# Altium project C27337A_NI_STS_IFX_C55SOI_302149633_V3_04.PrjPcb (part 1 of 2)
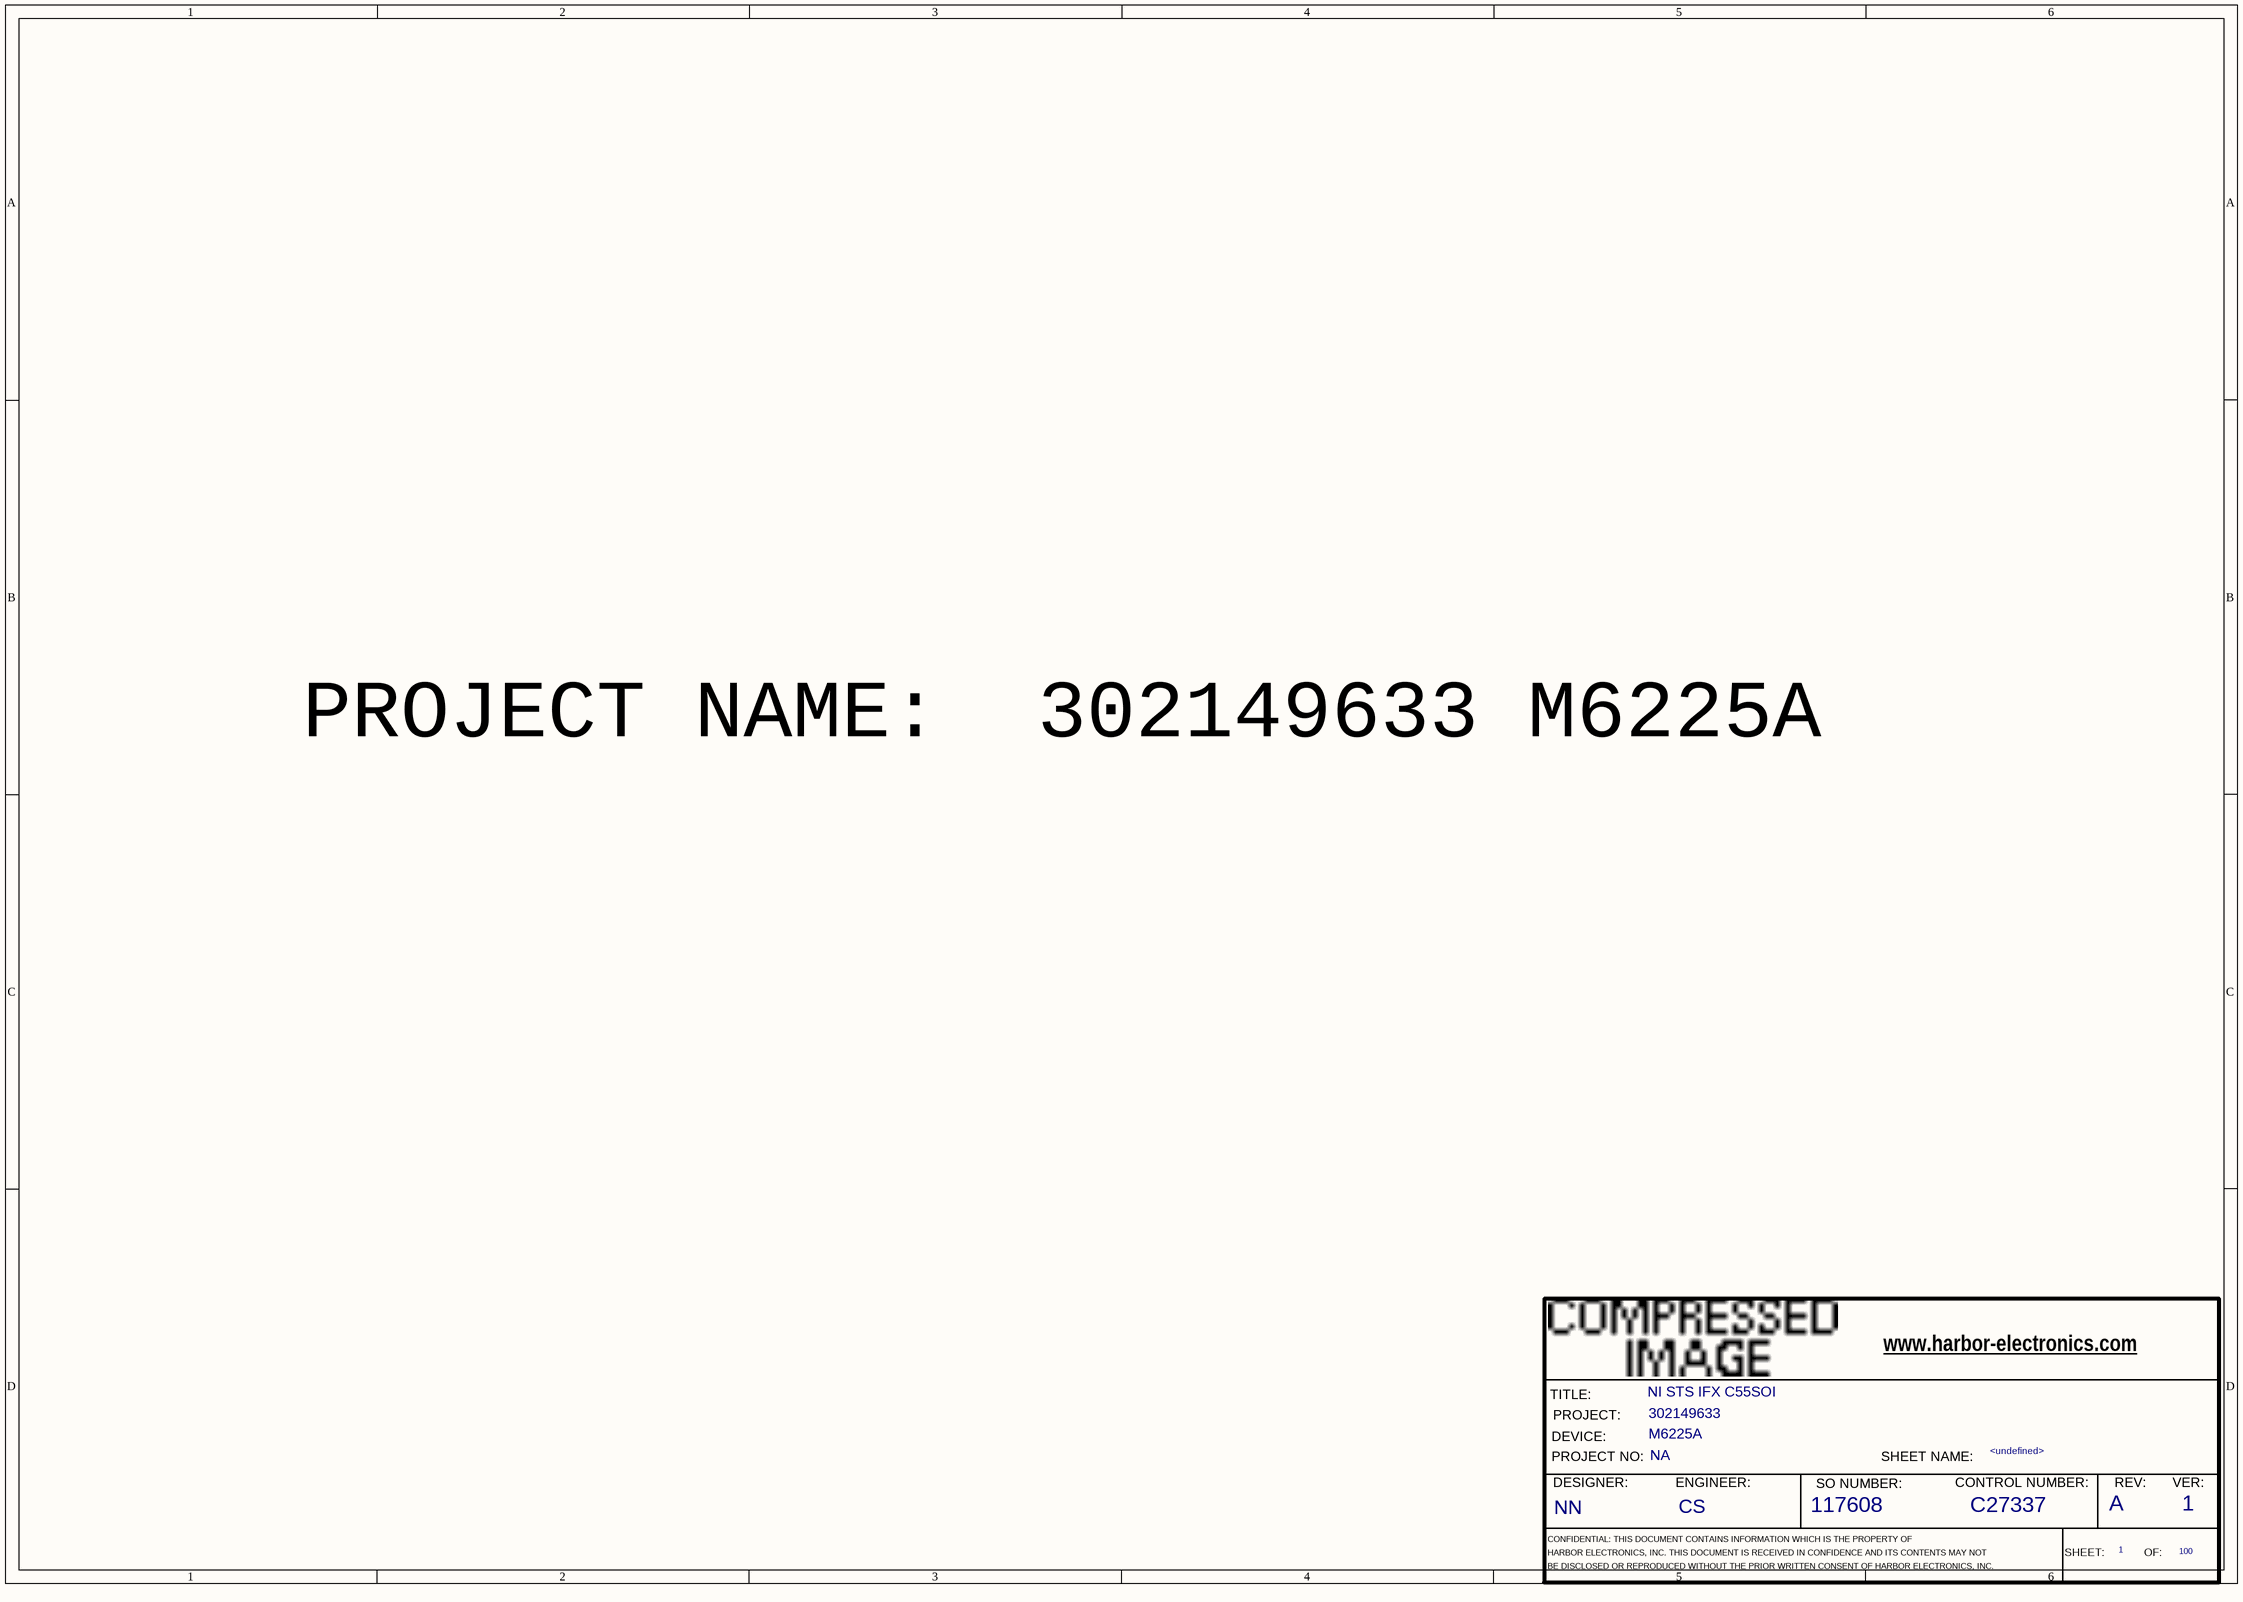
[diagram p0: 01-TITLE.SchDoc]
14 sheets, 208 parts. Net scope: flat (ports and power ports of the same name join across sheets).
Board file: c27337a_ni_sts_ifx_c55soi_302149633_m6225a_v1_23.brd.PcbDoc
Sheets:
  01-TITLE.SchDoc
  02-REVISION.SchDoc
  03-TESTER_CONFIG.SchDoc
  04-DUT0-1.SchDoc
  05-DUT2-3.SchDoc
  40-DIGITAL.SchDoc
  41-DIGITIZERS.SchDoc
  42-MIO.SchDoc
  43-PSU_SMU_HP.SchDoc
  45-RELAY_MUX_SWITCH.SchDoc
  47-SOURCES_AWG.SchDoc
  50-BLANK 101-120.SchDoc
  51-BLANK 121-140.SchDoc
  53-BLANK 161-180.SchDoc

## Sheet 01-TITLE.SchDoc
size 420 x 297 mm

### Parts
(Parts that share a designator on the sheet are numbered #1, #2 ... from top to bottom, then left to right.)
*#1  RevCode: A  Title: NI STS IFX C55SOI  Page Number: 1  Page Count: 100  Engineer: CS  Designer: NN  SO Number: 117608  Control Number: C27337  Page Name: <undefined>  PROJECT: 302149633  DEVICE: M6225A  PROJECT NO.: NA  (hidden comment: HE_DEFAULT)  (graphical)

### Notes on the sheet
- PROJECT NAME:  302149633 M6225A
- (in symbol HE_DEFAULT) www.harbor-electronics.com; TITLE:; PROJECT:; DEVICE:; PROJECT NO:; SHEET NAME:; DESIGNER:; ENGINEER:; CONTROL NUMBER:; REV:; VER:; SO NUMBER:; CONFIDENTIAL: THIS DOCUMENT CONTAINS INFORMATION WHICH IS THE PROPERTY OF; HARBOR ELECTRONICS, INC. THIS DOCUMENT IS RECEIVED IN CONFIDENCE AND ITS CONTENTS MAY NOT; SHEET:; OF:; BE DISCLOSED OR REPRODUCED WITHOUT THE PRIOR WRITTEN CONSENT OF HARBOR ELECTRONICS, INC.

### Library data of the parts
*#1 = HE_DEFAULT: Page Size: X; OrgAddr4: Fax: +1 602-431-9633; OrgAddr1: 4050 E. Cotton Center Blvd., Suite 33; OrgAddr2: Phoenix, Arizona 85040 U.S.A.; OrgAddr3: Phone: +1 602-438-1112; Doc: <Title Name>; OrgName: HARBOR; Version: 1

## Sheet 02-REVISION.SchDoc
size 420 x 297 mm
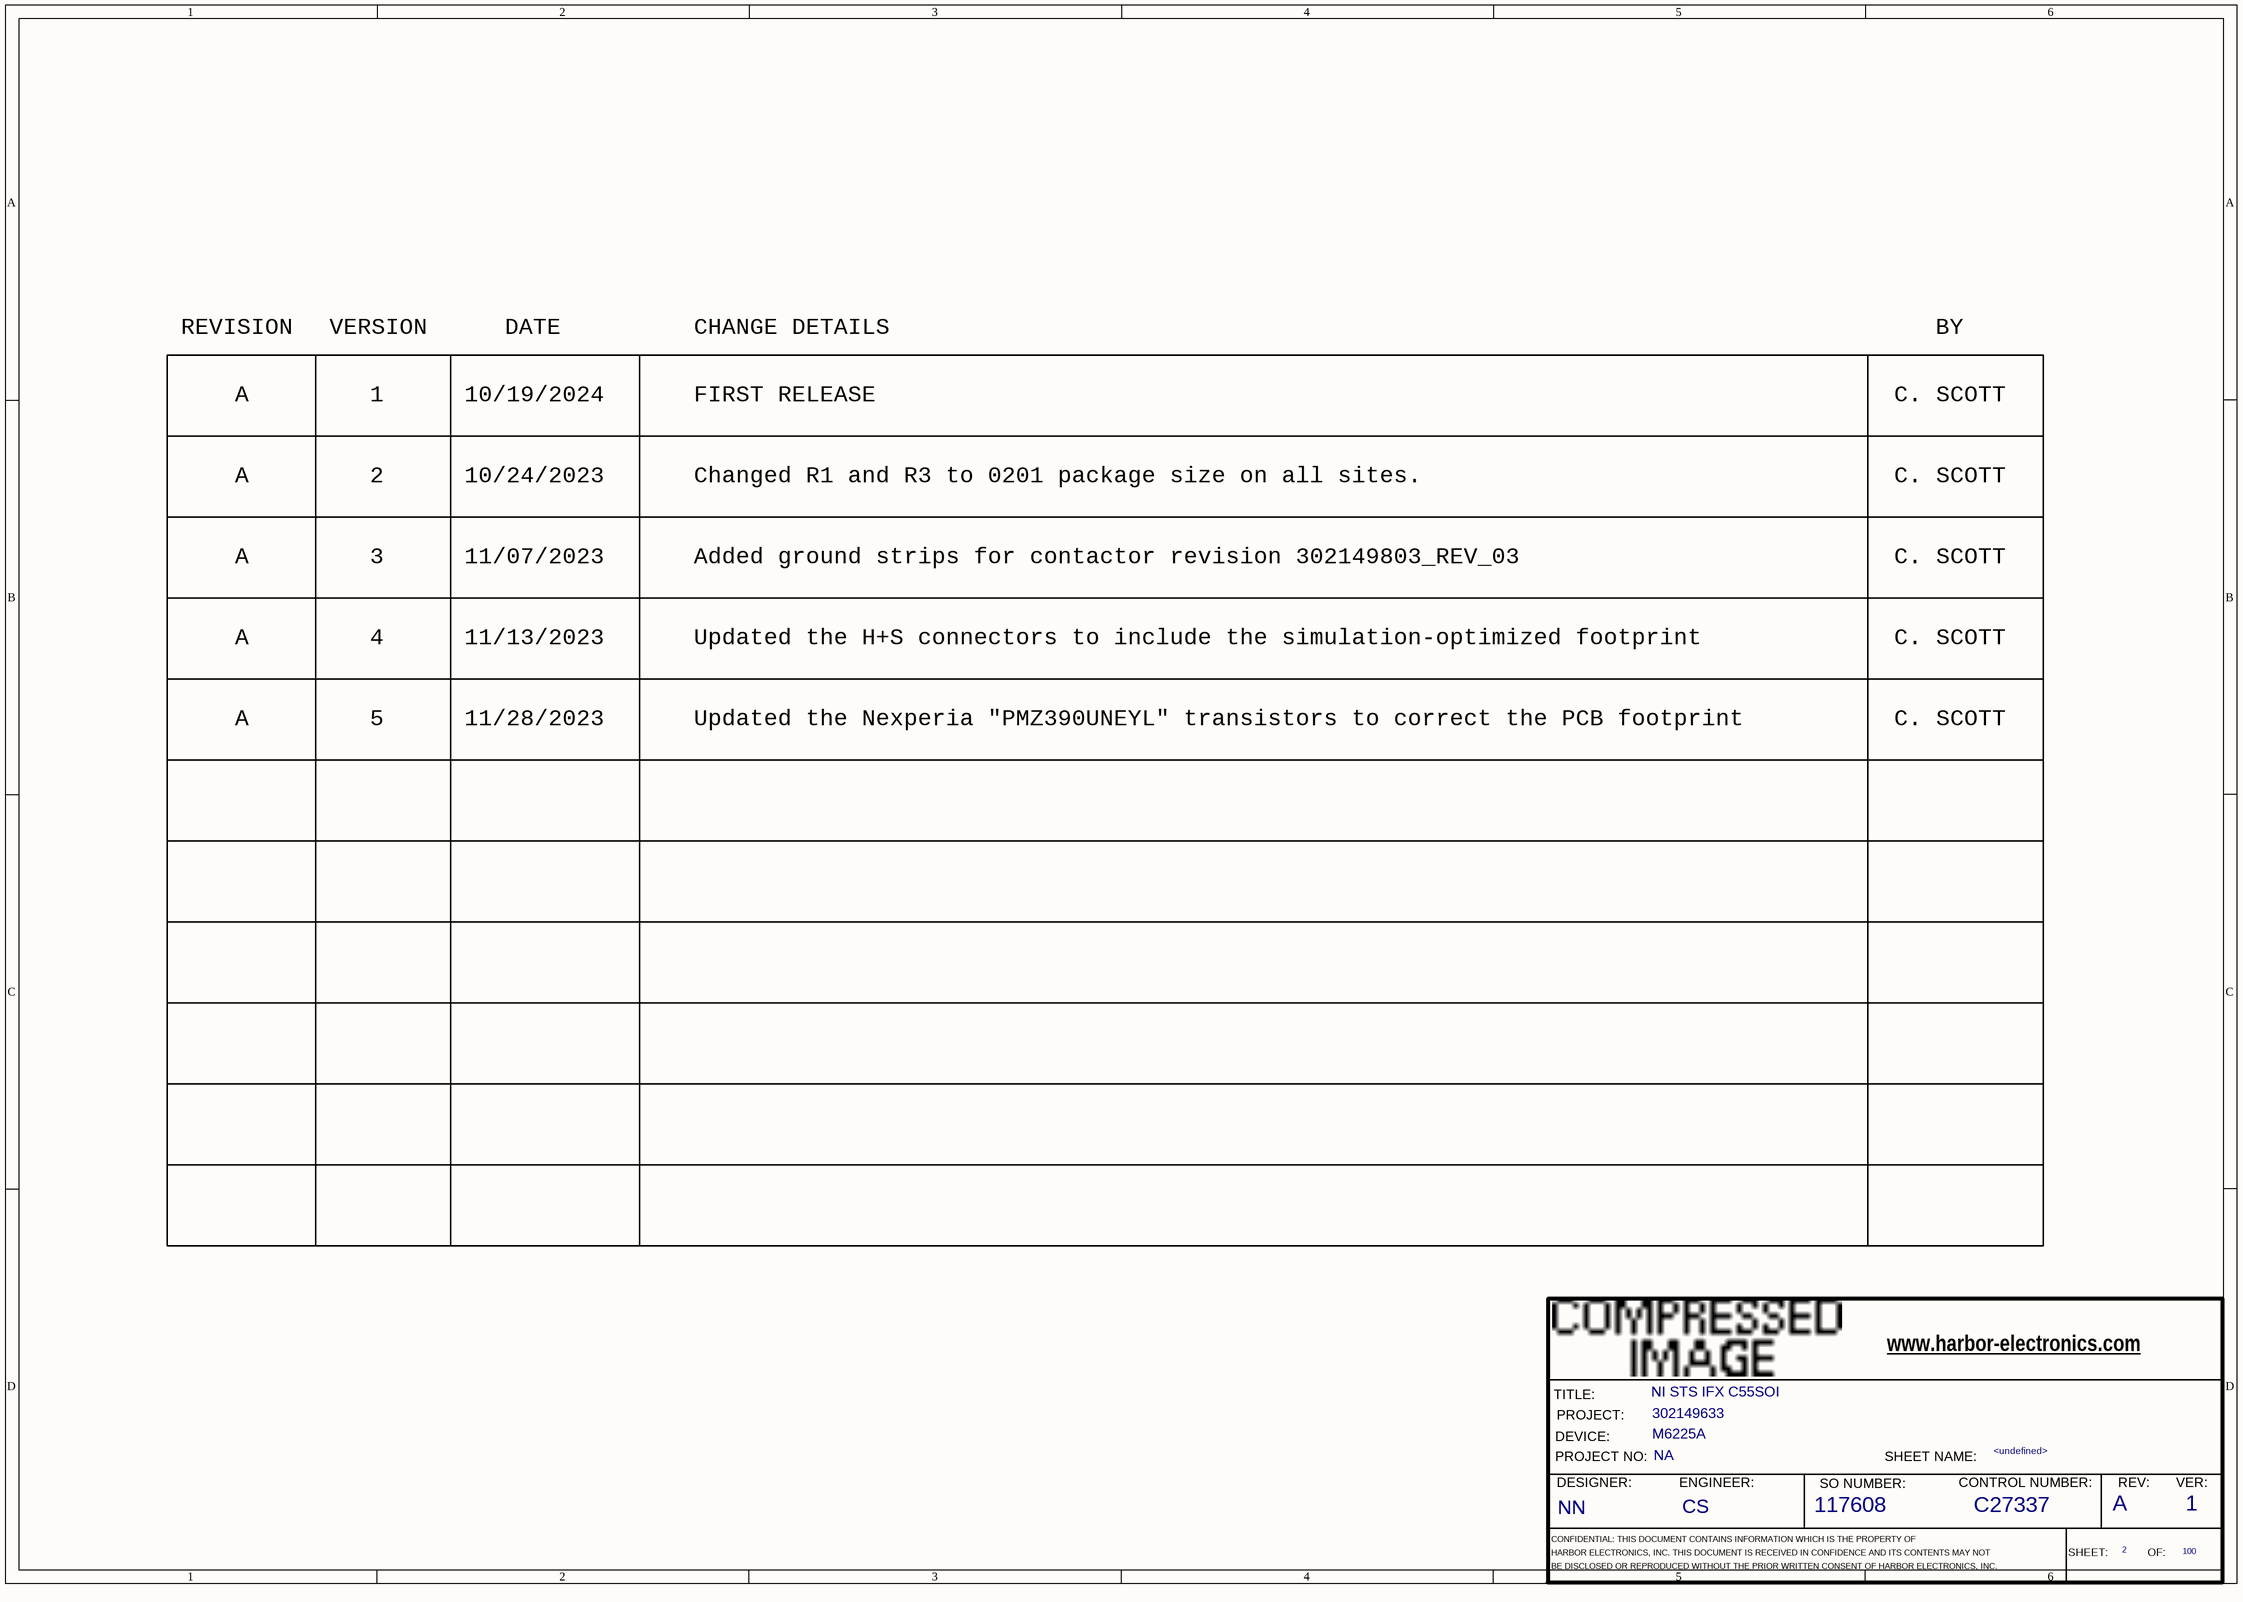
[diagram p1: 02-REVISION.SchDoc]

### Parts
(Parts that share a designator on the sheet are numbered #1, #2 ... from top to bottom, then left to right.)
*#2  RevCode: A  Title: NI STS IFX C55SOI  Page Number: 2  Page Count: 100  Engineer: CS  Designer: NN  SO Number: 117608  Control Number: C27337  Version: 1  Page Name: <undefined>  PROJECT: 302149633  DEVICE: M6225A  PROJECT NO.: NA  (hidden comment: HE_DEFAULT)  (graphical)

### Notes on the sheet
- REVISION
- VERSION
- DATE
- CHANGE DETAILS
- BY
- A
- 1
- 10/19/2024
- FIRST RELEASE
- C. SCOTT
- 2
- 10/24/2023
- Changed R1 and R3 to 0201 package size on all sites.
- 3
- 11/07/2023
- Added ground strips for contactor revision 302149803_REV_03
- 4
- 11/13/2023
- Updated the H+S connectors to include the simulation-optimized footprint
- 5
- 11/28/2023
- Updated the Nexperia "PMZ390UNEYL" transistors to correct the PCB footprint
- (in symbol HE_DEFAULT) www.harbor-electronics.com; TITLE:; PROJECT:; DEVICE:; PROJECT NO:; SHEET NAME:; DESIGNER:; ENGINEER:; CONTROL NUMBER:; REV:; VER:; SO NUMBER:; CONFIDENTIAL: THIS DOCUMENT CONTAINS INFORMATION WHICH IS THE PROPERTY OF; HARBOR ELECTRONICS, INC. THIS DOCUMENT IS RECEIVED IN CONFIDENCE AND ITS CONTENTS MAY NOT; SHEET:; OF:; BE DISCLOSED OR REPRODUCED WITHOUT THE PRIOR WRITTEN CONSENT OF HARBOR ELECTRONICS, INC.

### Library data of the parts
*#2 = HE_DEFAULT: as *#1 on sheet 01-TITLE

## Sheet 03-TESTER_CONFIG.SchDoc
size 594 x 420 mm
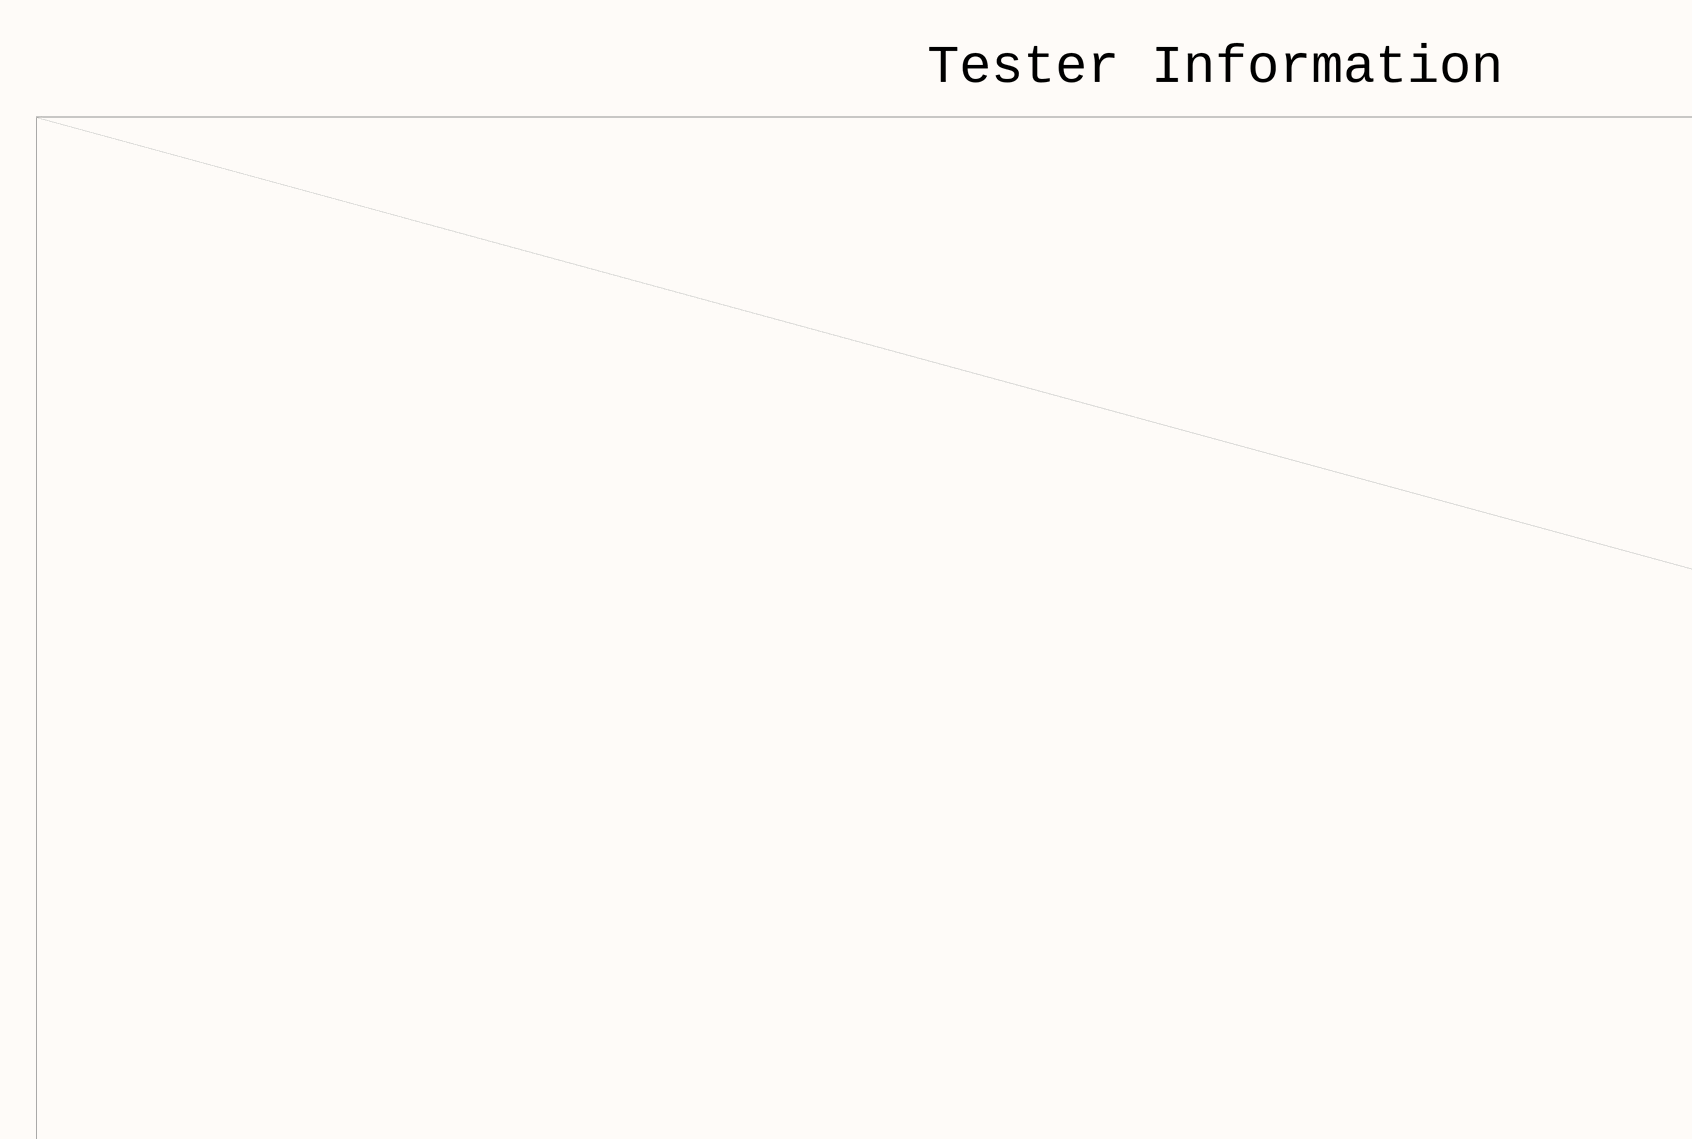
[diagram p2: 03-TESTER_CONFIG.SchDoc, top column 1 of 4]
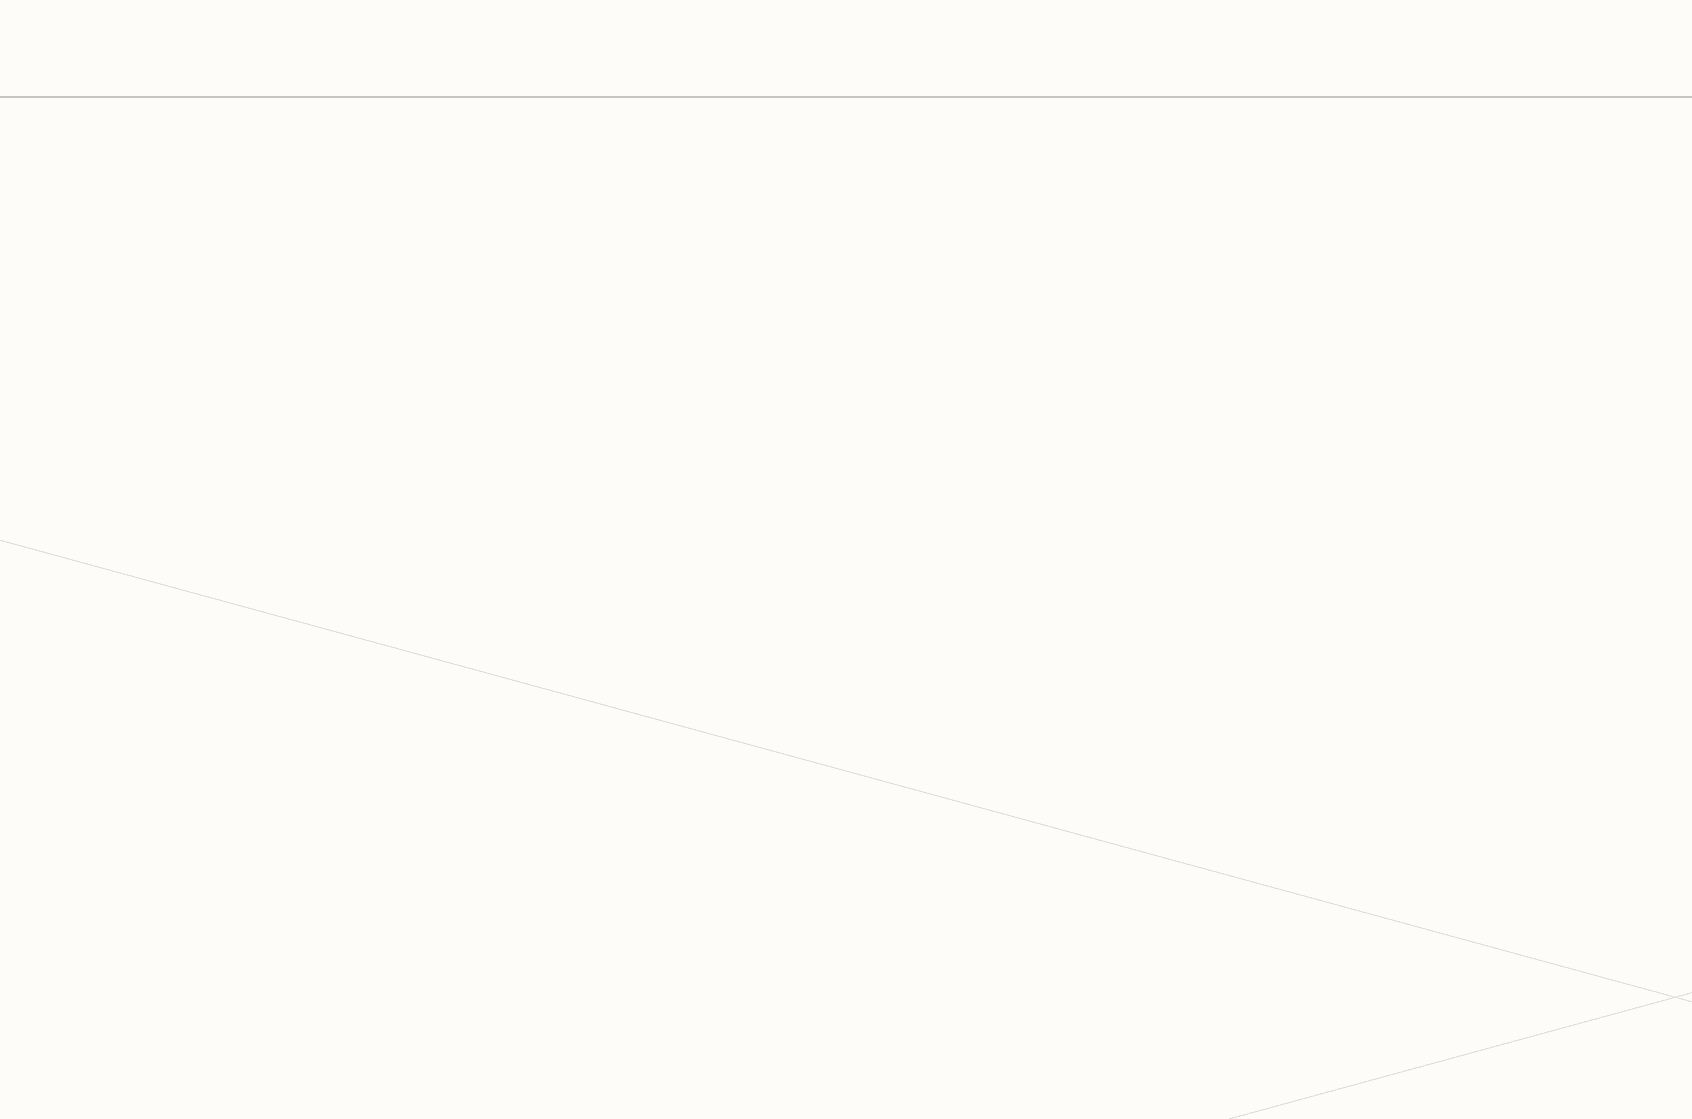
[diagram p3: 03-TESTER_CONFIG.SchDoc, top column 2 of 4]
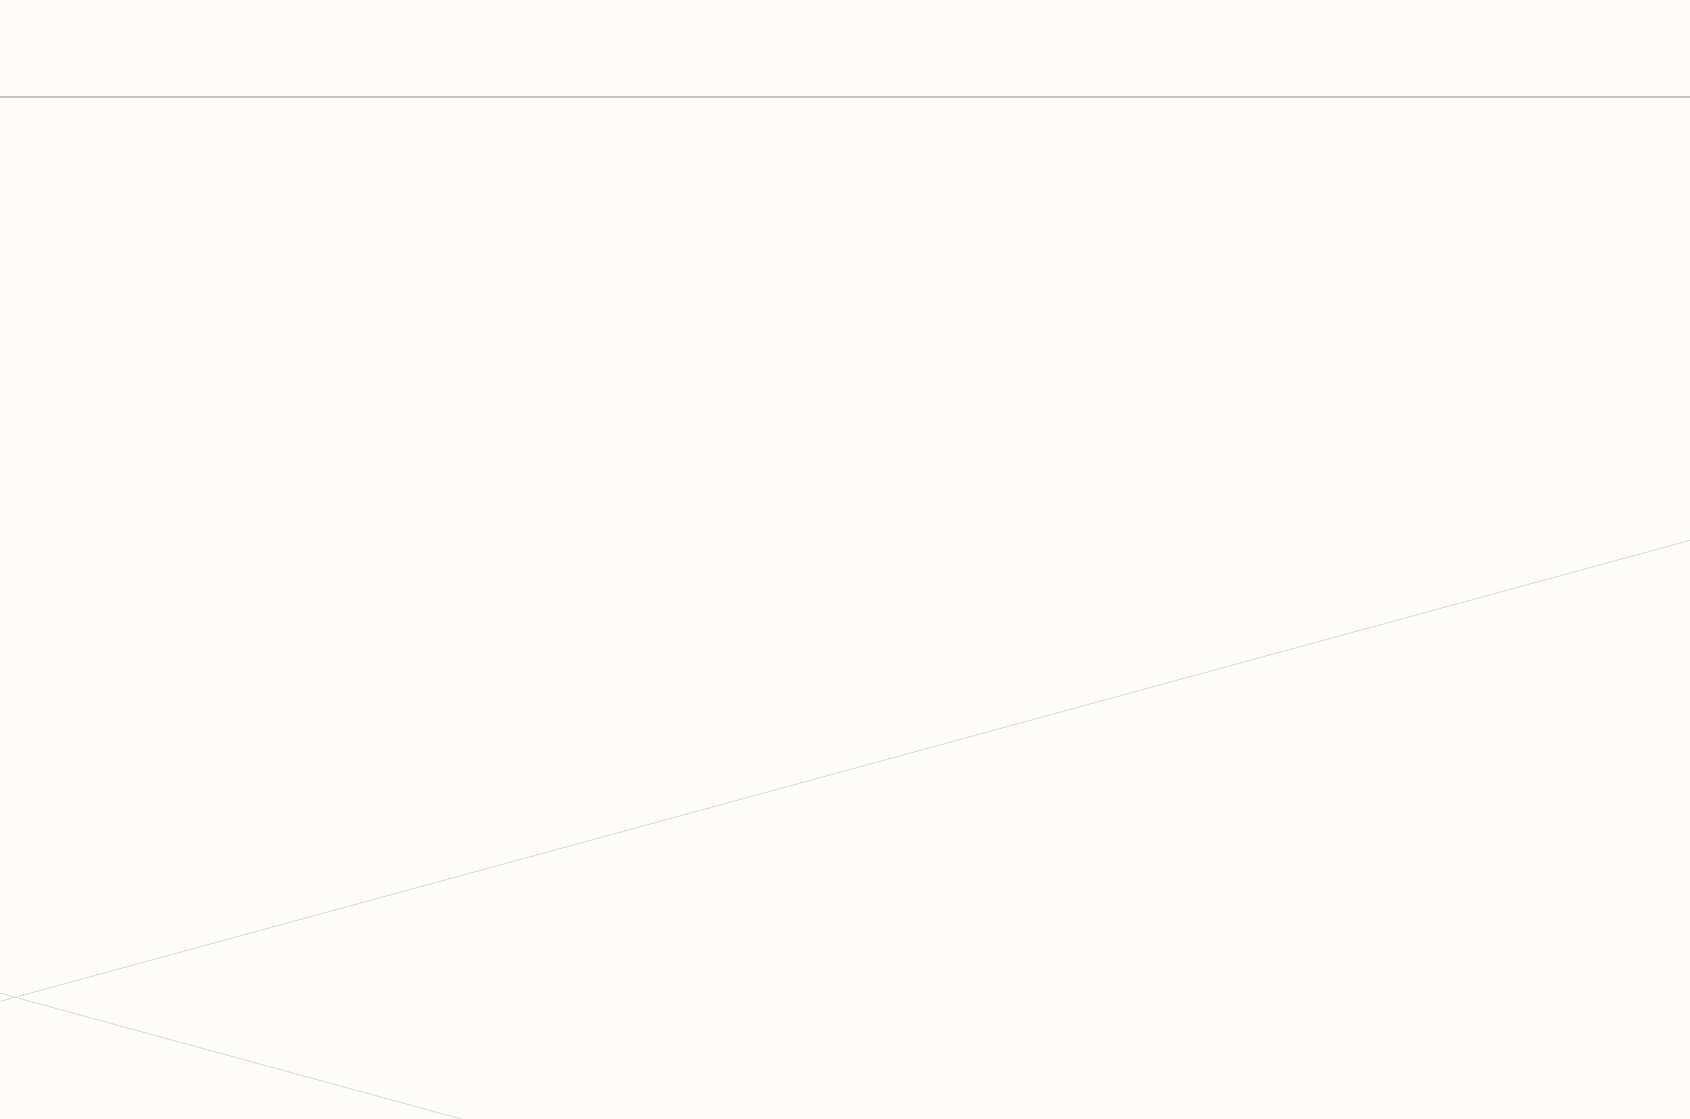
[diagram p4: 03-TESTER_CONFIG.SchDoc, top column 3 of 4]
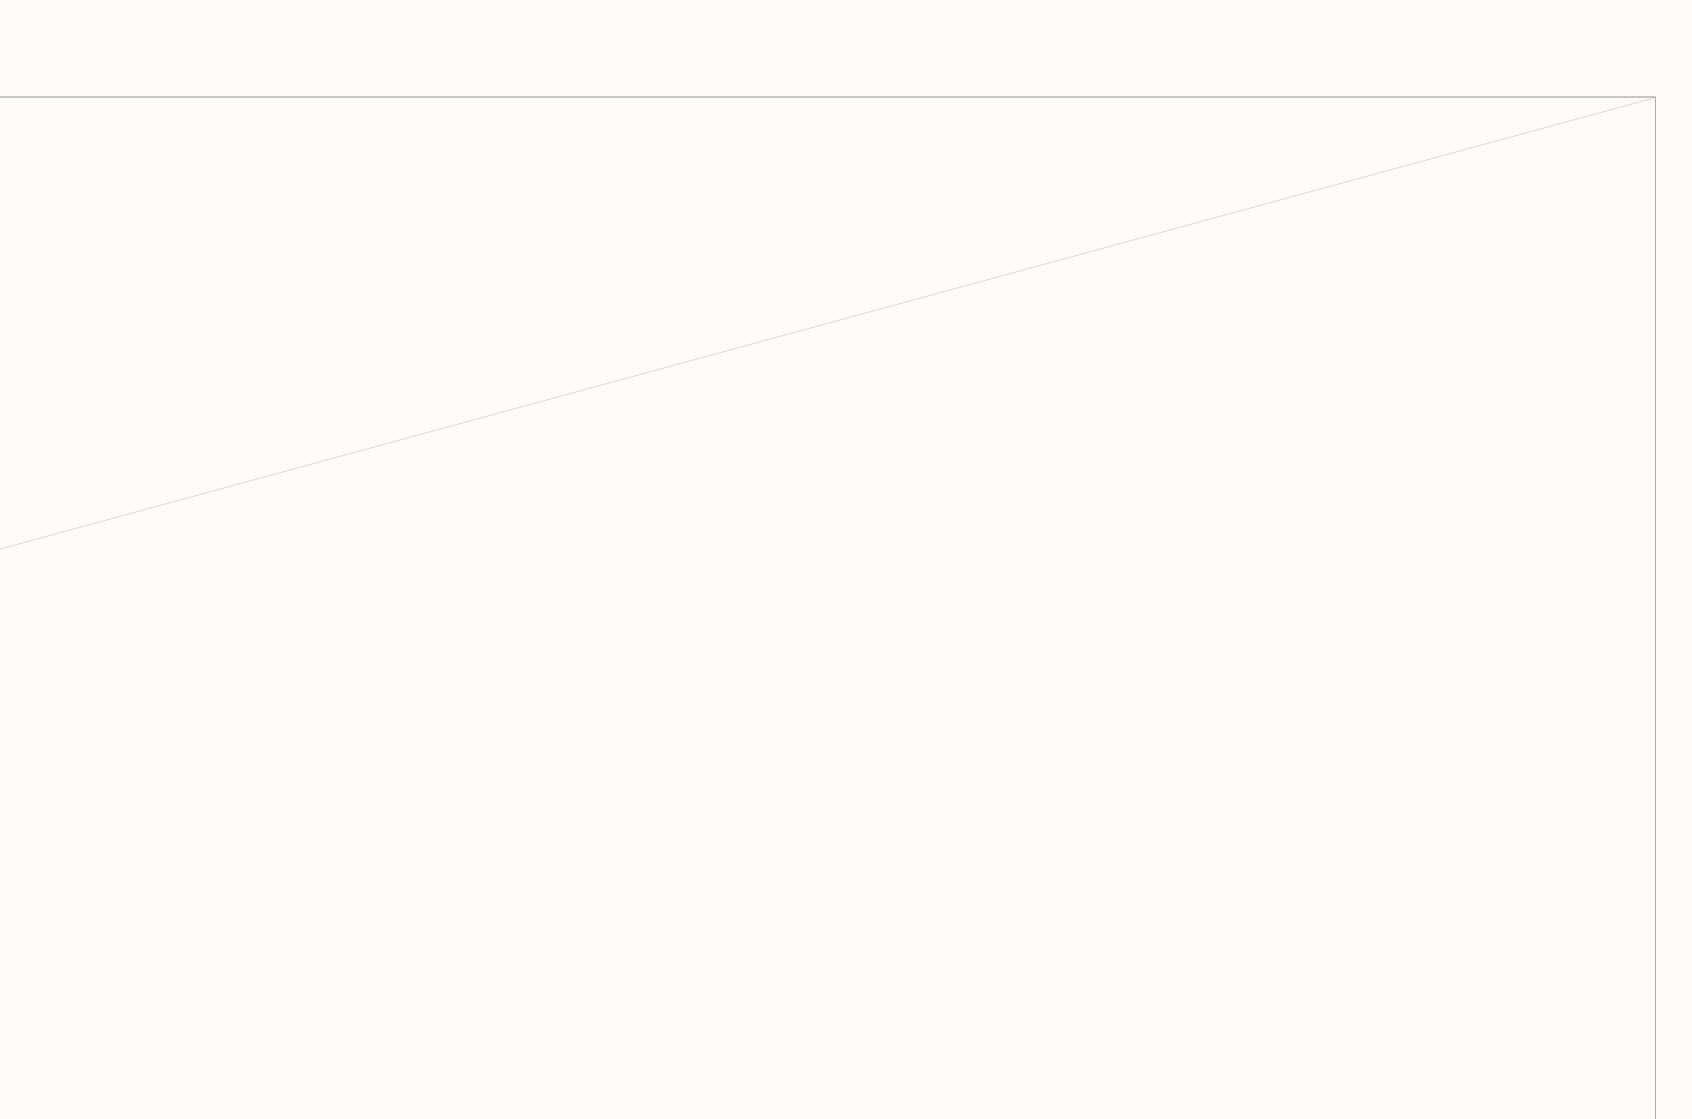
[diagram p5: 03-TESTER_CONFIG.SchDoc, top column 4 of 4]
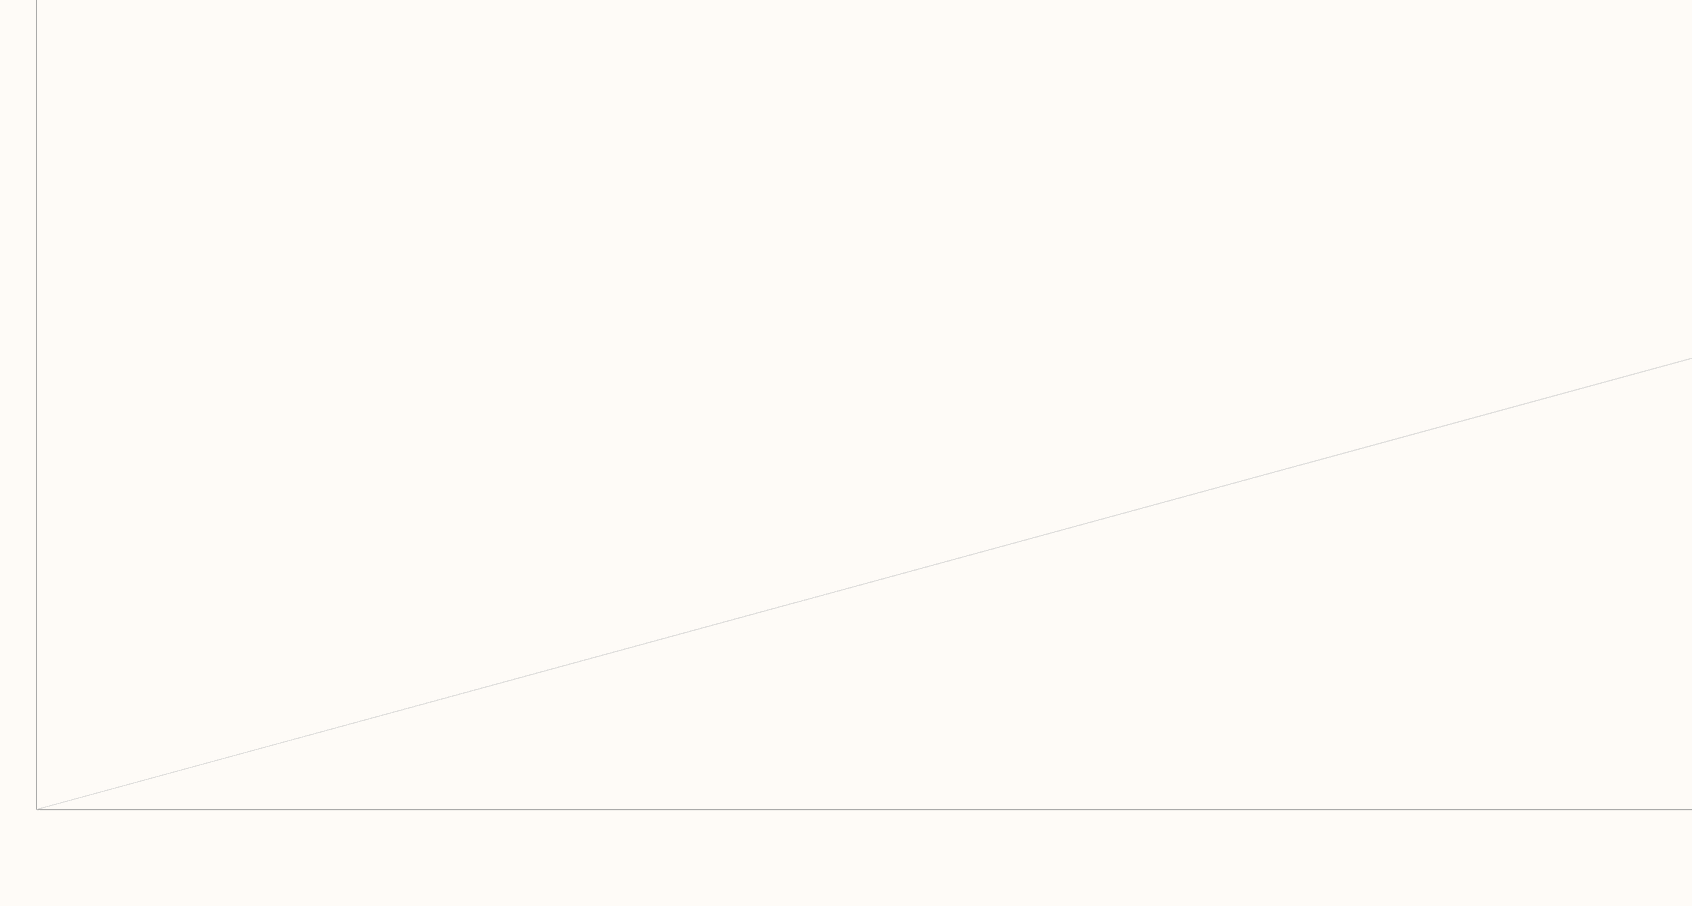
[diagram p6: 03-TESTER_CONFIG.SchDoc, bottom column 1 of 4]
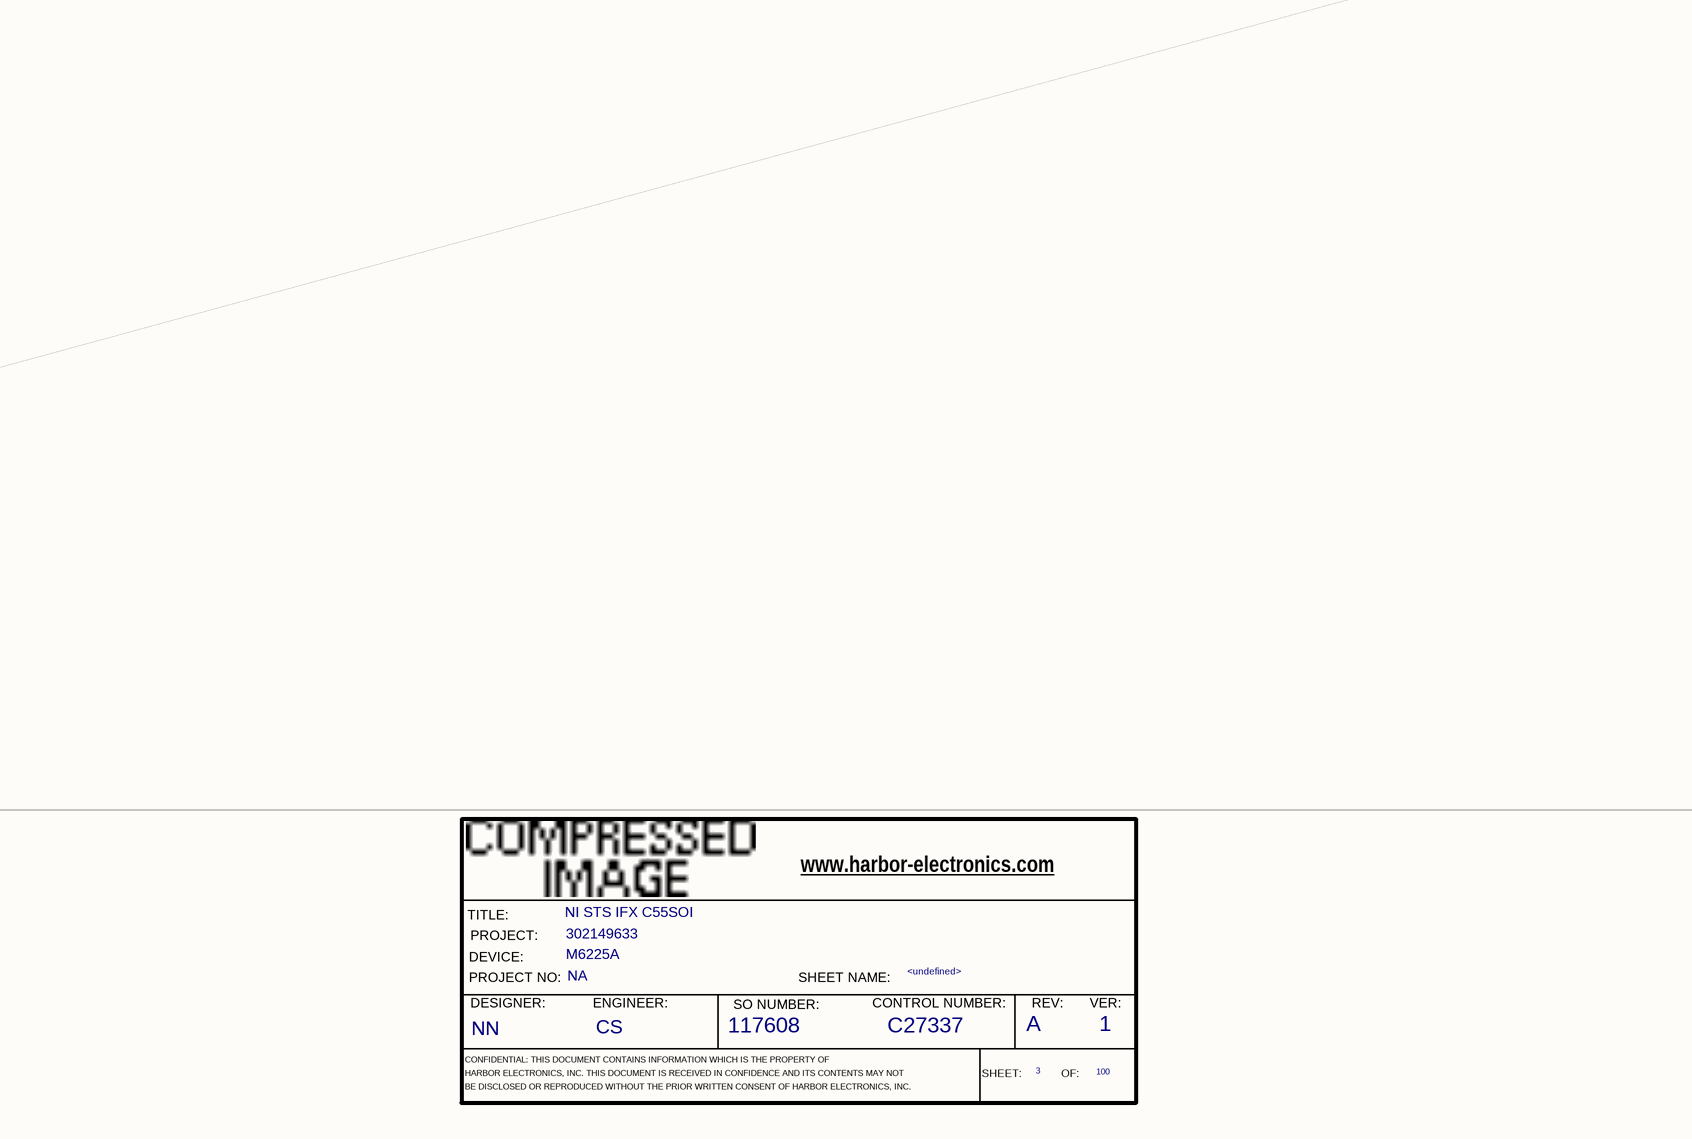
[diagram p7: 03-TESTER_CONFIG.SchDoc, bottom column 2 of 4]
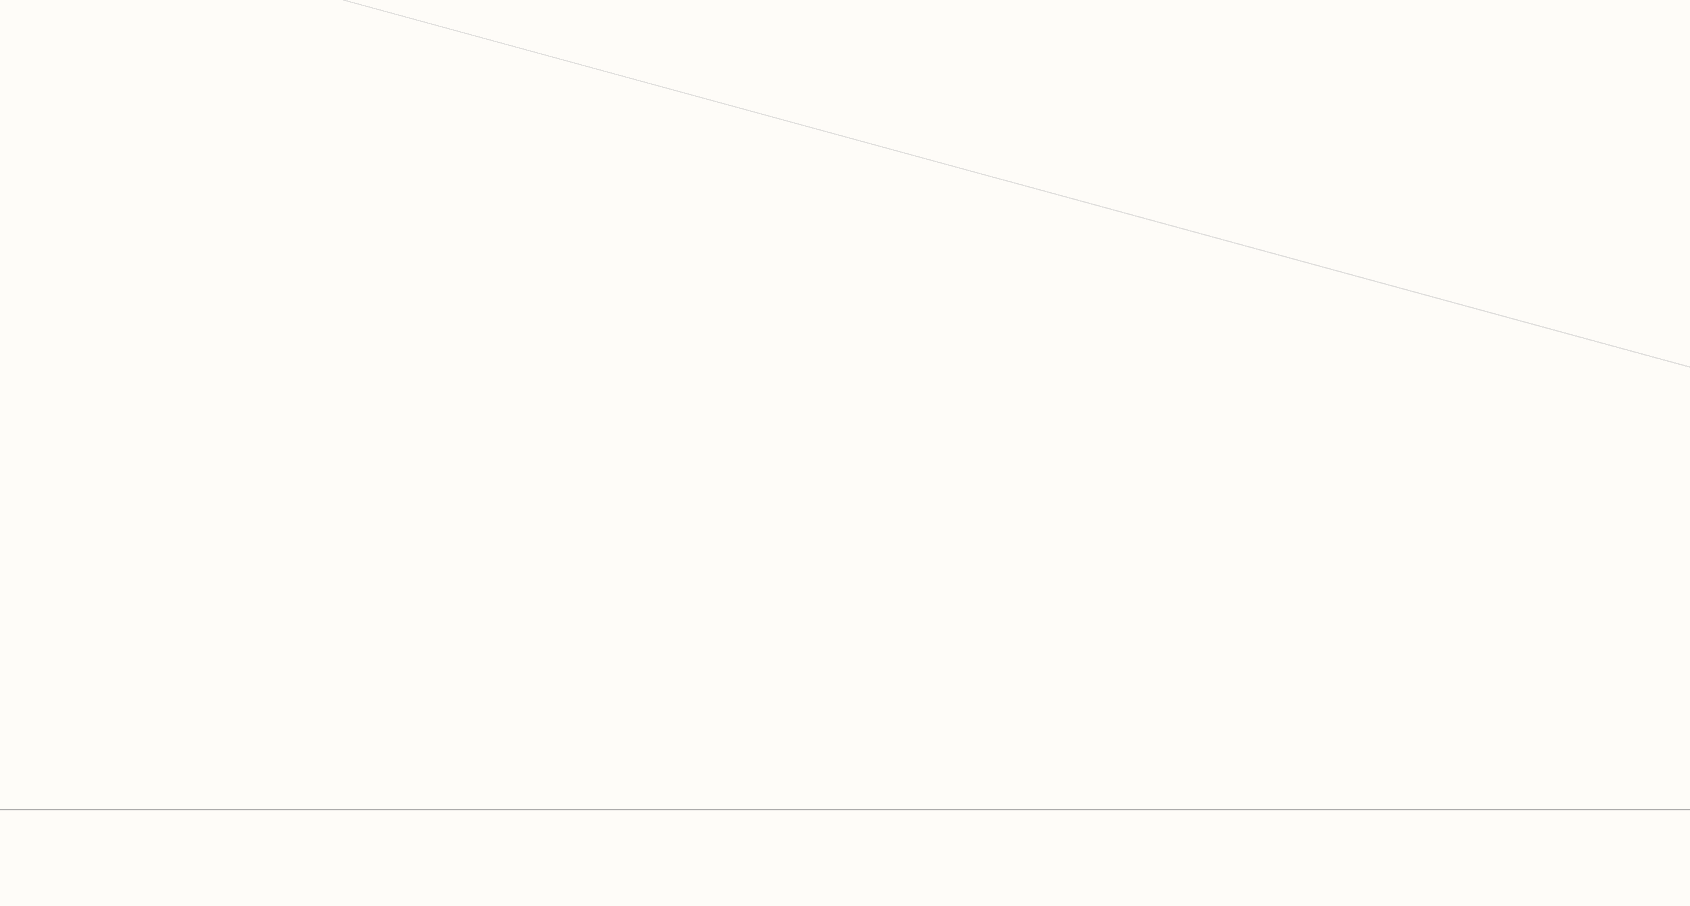
[diagram p8: 03-TESTER_CONFIG.SchDoc, bottom column 3 of 4]
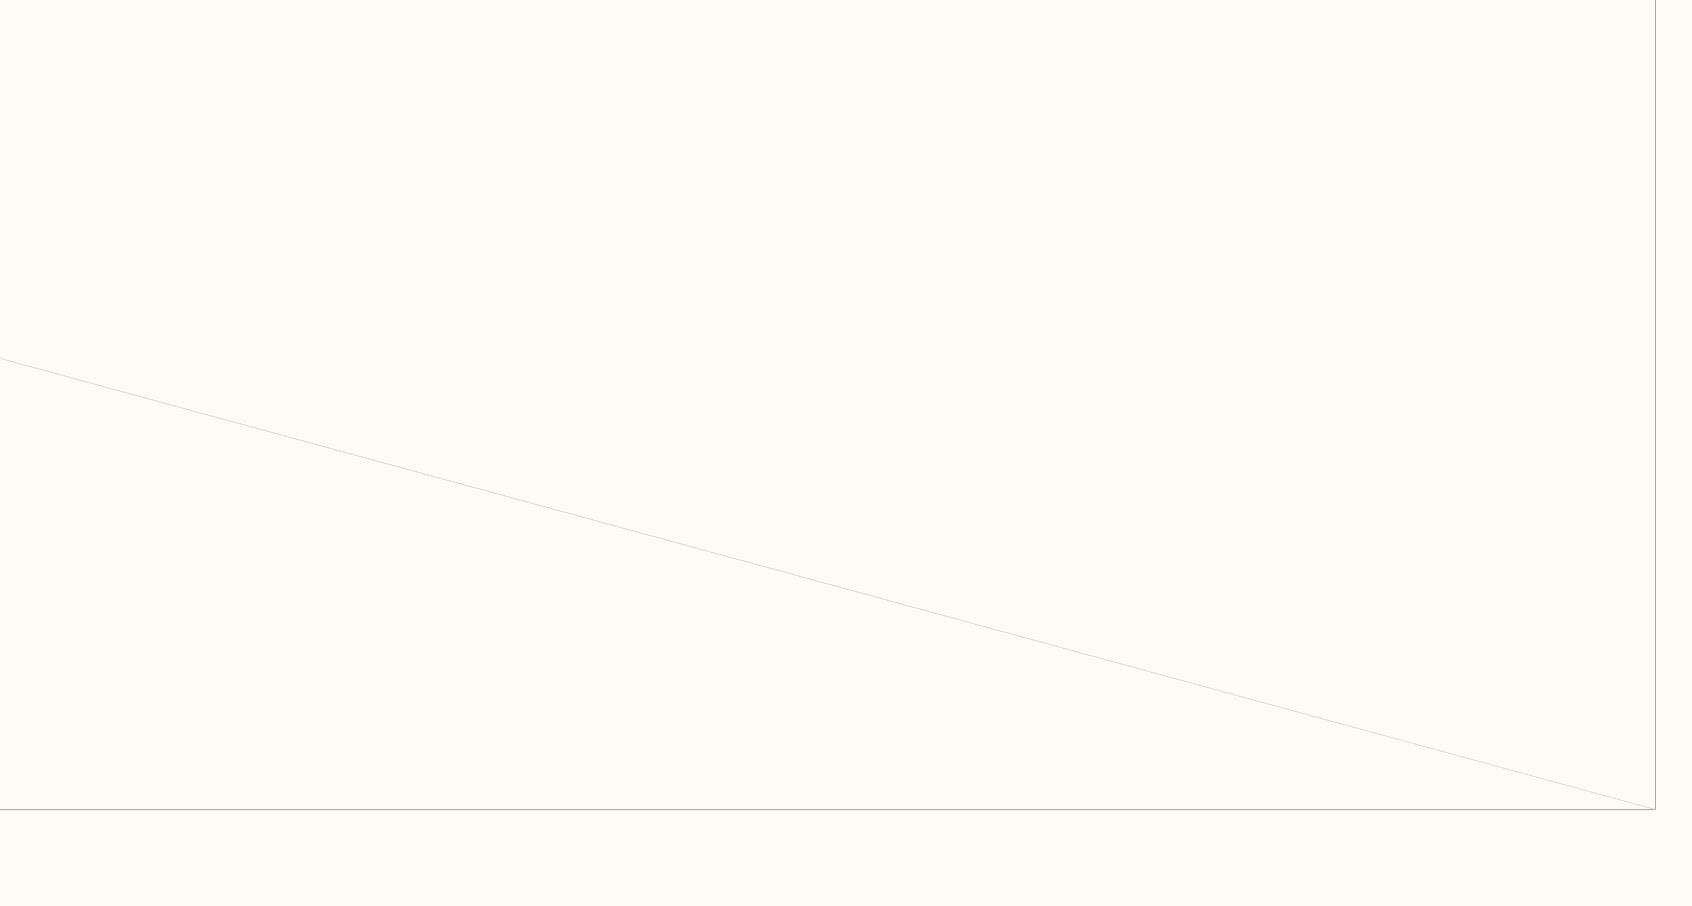
[diagram p9: 03-TESTER_CONFIG.SchDoc, bottom column 4 of 4]

### Parts
(Parts that share a designator on the sheet are numbered #1, #2 ... from top to bottom, then left to right.)
*#3  RevCode: A  Title: NI STS IFX C55SOI  Page Number: 3  Page Count: 100  Engineer: CS  Designer: NN  SO Number: 117608  Control Number: C27337  Version: 1  Page Name: <undefined>  PROJECT: 302149633  DEVICE: M6225A  PROJECT NO.: NA  (hidden comment: HE_DEFAULT)  (graphical)

### Notes on the sheet
- Tester Information
- (in symbol HE_DEFAULT) www.harbor-electronics.com; TITLE:; PROJECT:; DEVICE:; PROJECT NO:; SHEET NAME:; DESIGNER:; ENGINEER:; SO NUMBER:; CONTROL NUMBER:; REV:; VER:; CONFIDENTIAL: THIS DOCUMENT CONTAINS INFORMATION WHICH IS THE PROPERTY OF; HARBOR ELECTRONICS, INC. THIS DOCUMENT IS RECEIVED IN CONFIDENCE AND ITS CONTENTS MAY NOT; SHEET:; OF:; BE DISCLOSED OR REPRODUCED WITHOUT THE PRIOR WRITTEN CONSENT OF HARBOR ELECTRONICS, INC.

### Library data of the parts
*#3 = HE_DEFAULT: as *#1 on sheet 01-TITLE

## Sheet 04-DUT0-1.SchDoc
size 594 x 420 mm
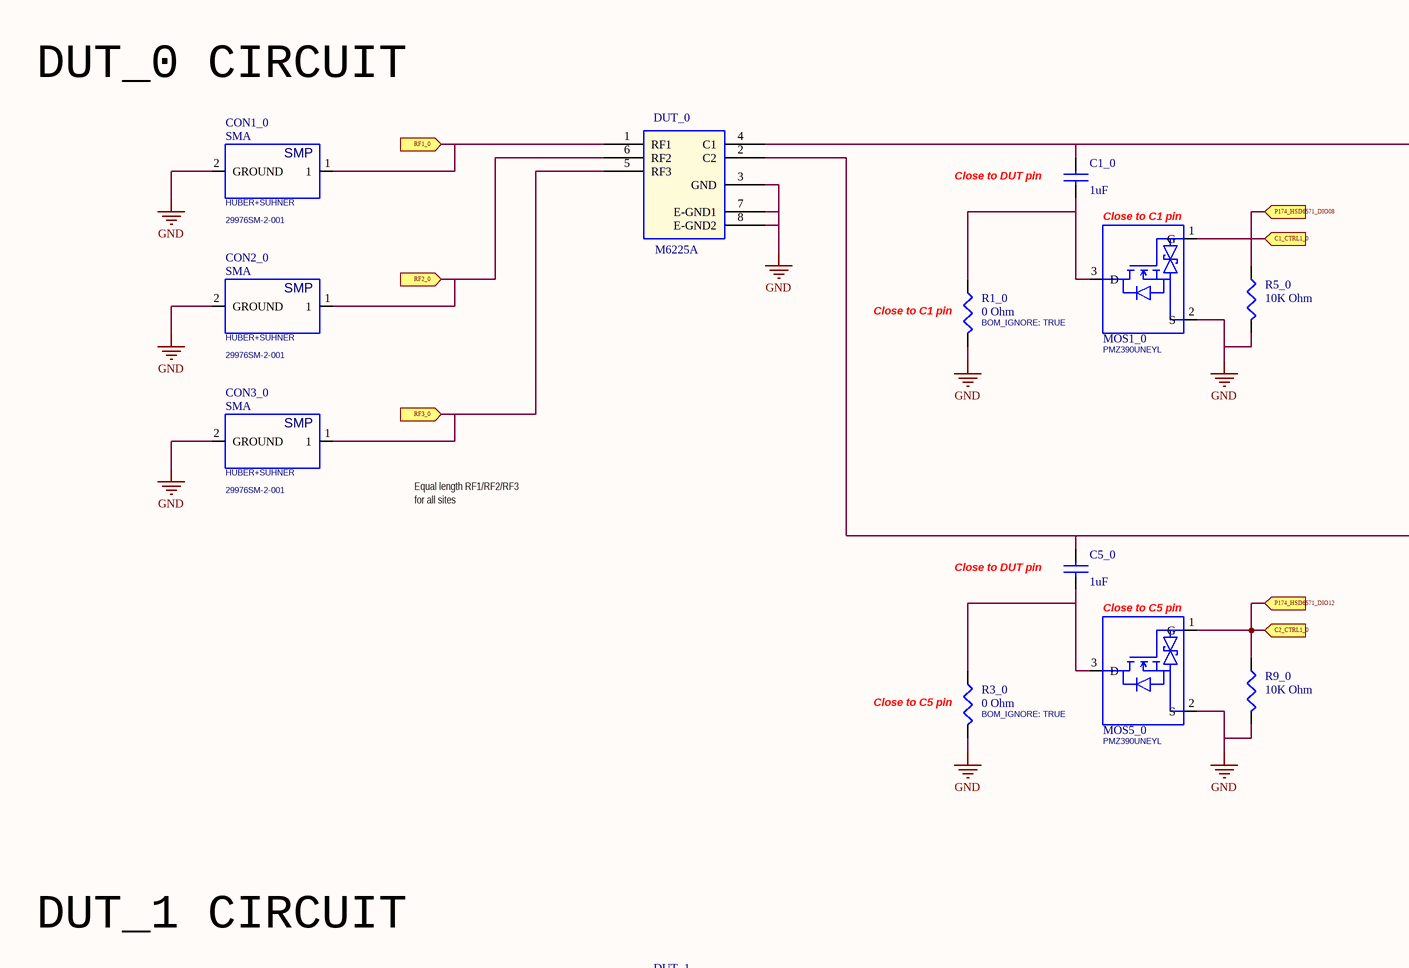
[diagram p10: 04-DUT0-1.SchDoc, top left]
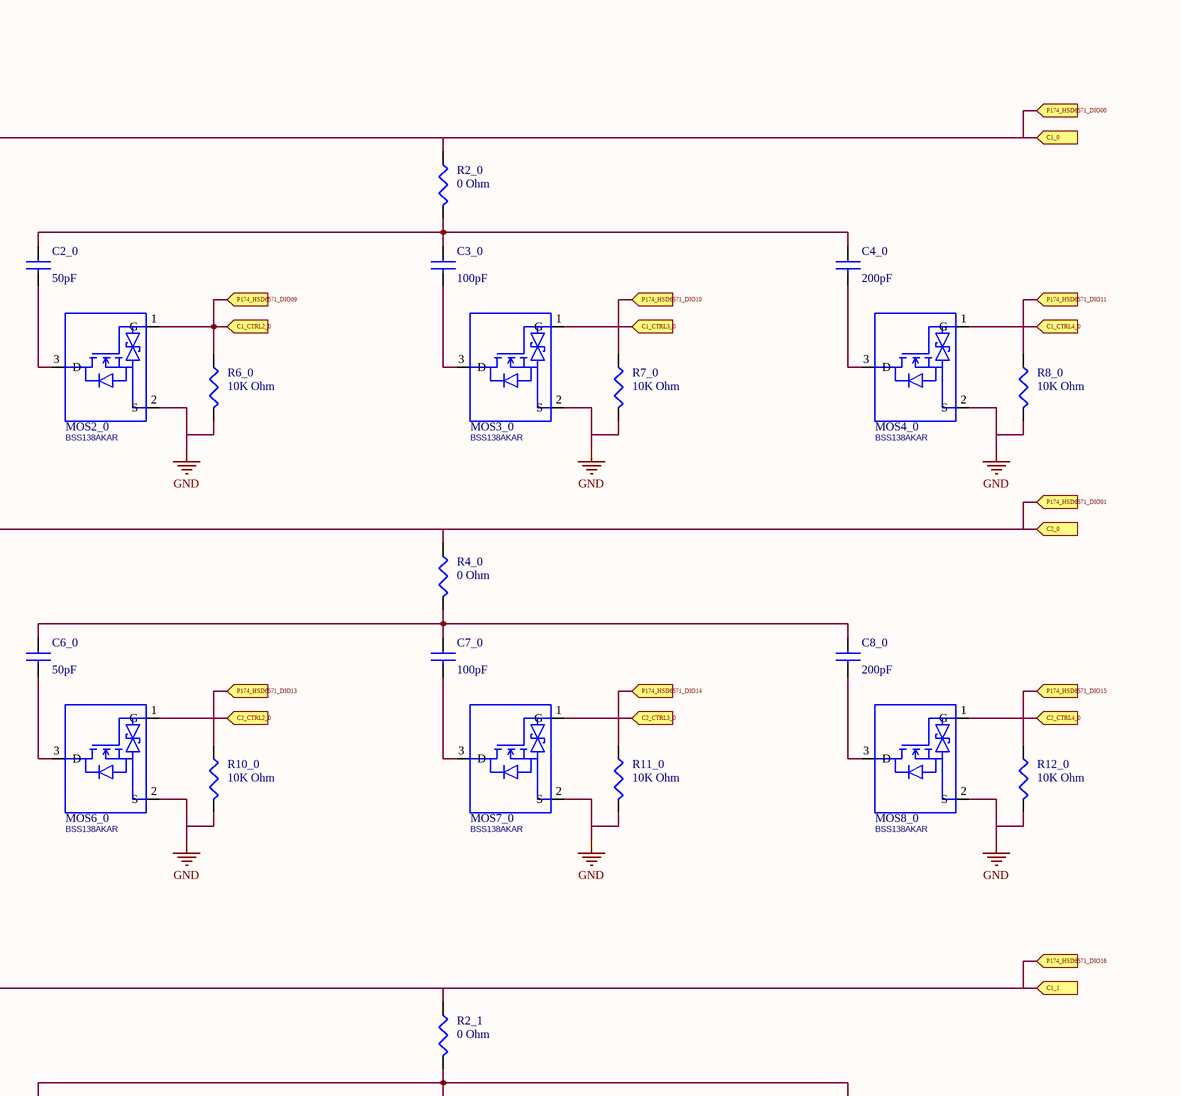
[diagram p11: 04-DUT0-1.SchDoc, top right]
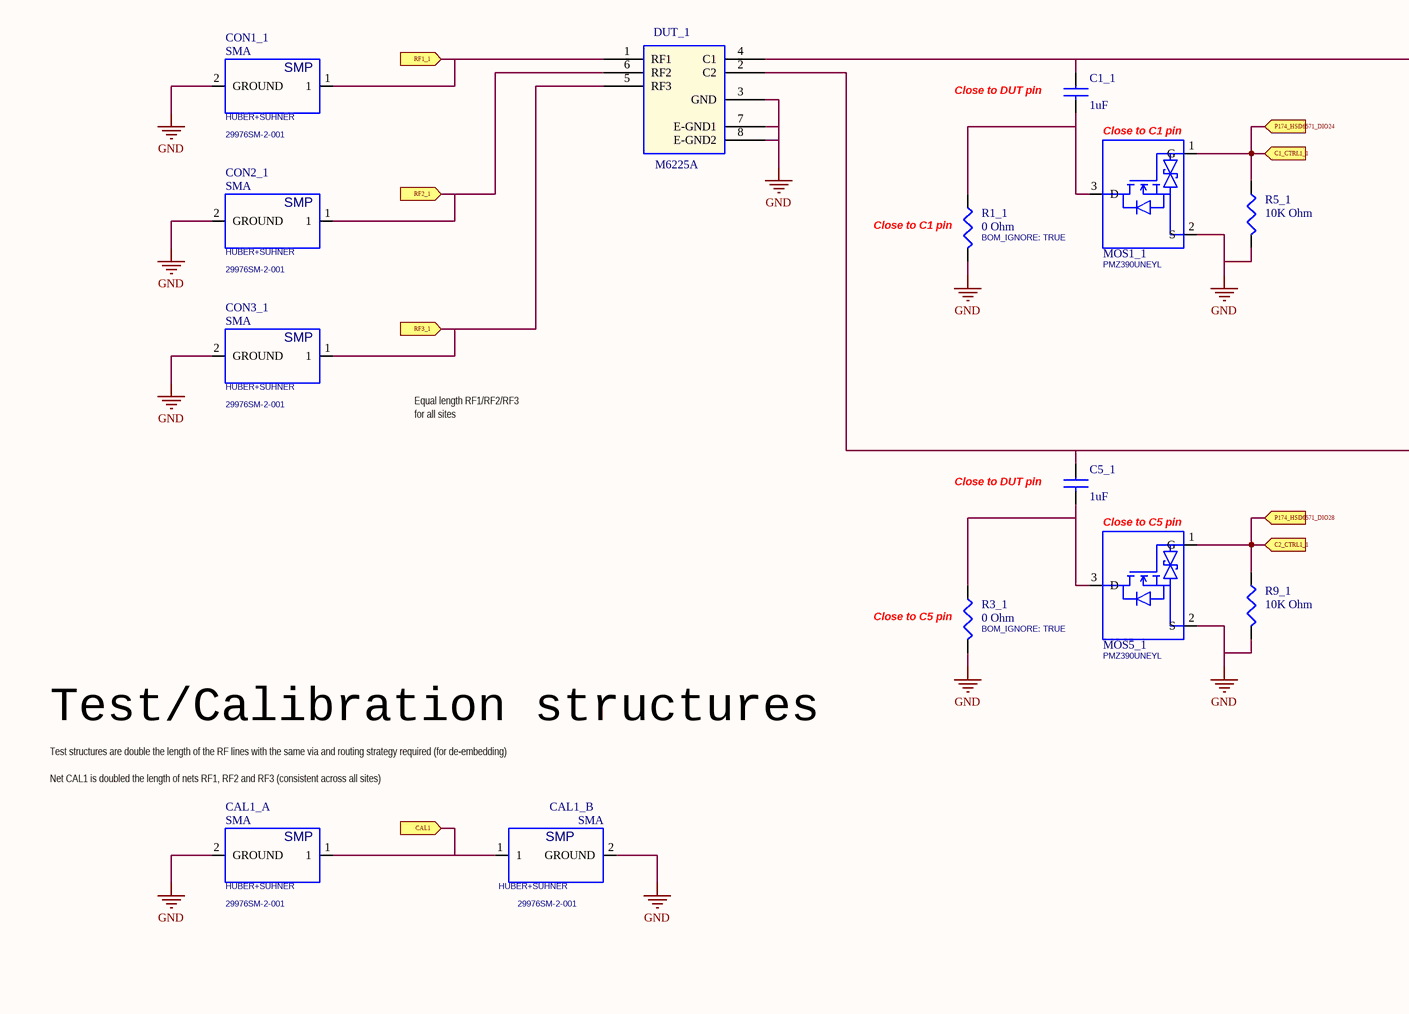
[diagram p12: 04-DUT0-1.SchDoc, bottom left]
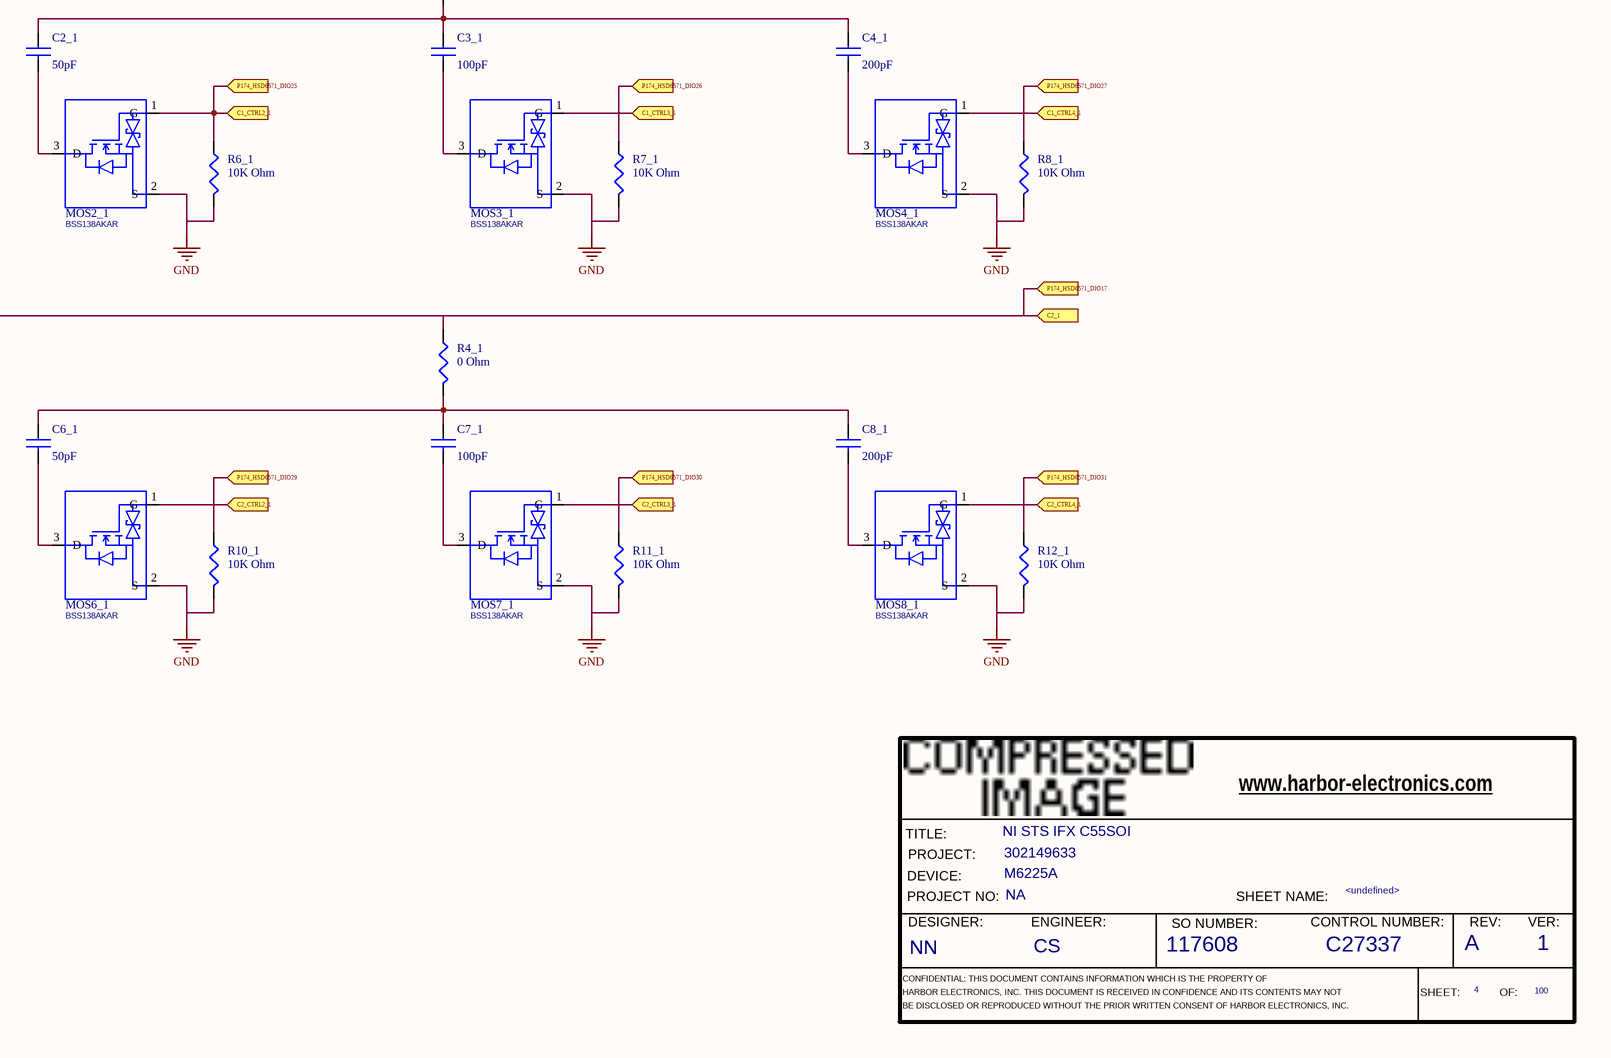
[diagram p13: 04-DUT0-1.SchDoc, bottom right]

### Parts
(Parts that share a designator on the sheet are numbered #1, #2 ... from top to bottom, then left to right.)
*#4  RevCode: A  Title: NI STS IFX C55SOI  Page Number: 4  Page Count: 100  Engineer: CS  Designer: NN  SO Number: 117608  Control Number: C27337  Version: 1  Page Name: <undefined>  PROJECT: 302149633  DEVICE: M6225A  PROJECT NO.: NA  (hidden comment: HE_DEFAULT)  (graphical)
C1_0  1uF  [CAPC1005X65NA]
C1_1  1uF  [CAPC1005X65NA]
C2_0  50pF  [CAPC2012X150NA]
C2_1  50pF  [CAPC2012X150NA]
C3_0  100pF  [CAPC2012X150NA]
C3_1  100pF  [CAPC2012X150NA]
C4_0  200pF  [CAPC2012X150NA]
C4_1  200pF  [CAPC2012X150NA]
C5_0  1uF  [CAPC1005X65NA]
C5_1  1uF  [CAPC1005X65NA]
C6_0  50pF  [CAPC2012X150NA]
C6_1  50pF  [CAPC2012X150NA]
C7_0  100pF  [CAPC2012X150NA]
C7_1  100pF  [CAPC2012X150NA]
C8_0  200pF  [CAPC2012X150NA]
C8_1  200pF  [CAPC2012X150NA]
CAL1_A  SMA  MANUFACTURER: HUBER+SUHNER  PART_NUMBER: 29976SM-2-001  [HUBER_SUHNER_29976SM_2_001NA]
CAL1_B  SMA  MANUFACTURER: HUBER+SUHNER  PART_NUMBER: 29976SM-2-001  [HUBER_SUHNER_29976SM_2_001NA]
CON1_0  SMA  MANUFACTURER: HUBER+SUHNER  PART_NUMBER: 29976SM-2-001  [HUBER_SUHNER_29976SM_2_001NA]
CON1_1  SMA  MANUFACTURER: HUBER+SUHNER  PART_NUMBER: 29976SM-2-001  [HUBER_SUHNER_29976SM_2_001NA]
CON2_0  SMA  PART_NUMBER: 29976SM-2-001  MANUFACTURER: HUBER+SUHNER  [HUBER_SUHNER_29976SM_2_001NA]
CON2_1  SMA  PART_NUMBER: 29976SM-2-001  MANUFACTURER: HUBER+SUHNER  [HUBER_SUHNER_29976SM_2_001NA]
CON3_0  SMA  PART_NUMBER: 29976SM-2-001  MANUFACTURER: HUBER+SUHNER  [HUBER_SUHNER_29976SM_2_001NA]
CON3_1  SMA  PART_NUMBER: 29976SM-2-001  MANUFACTURER: HUBER+SUHNER  [HUBER_SUHNER_29976SM_2_001NA]
DUT_0  M6225A  [dut_302149803]
DUT_1  M6225A  [dut_302149803]
MOS1_0  PART_NUMBER: PMZ390UNEYL  [DFN1006_3NB]  (hidden comment: SINGLE)
MOS1_1  PART_NUMBER: PMZ390UNEYL  [DFN1006_3NB]  (hidden comment: SINGLE)
MOS2_0  SINGLE  [SOT95P240X130_3NA]  (value not drawn)
MOS2_1  SINGLE  [SOT95P240X130_3NA]  (value not drawn)
MOS3_0  SINGLE  [SOT95P240X130_3NA]  (value not drawn)
MOS3_1  SINGLE  [SOT95P240X130_3NA]  (value not drawn)
MOS4_0  SINGLE  [SOT95P240X130_3NA]  (value not drawn)
MOS4_1  SINGLE  [SOT95P240X130_3NA]  (value not drawn)
MOS5_0  PART_NUMBER: PMZ390UNEYL  [DFN1006_3NB]  (hidden comment: SINGLE)
MOS5_1  PART_NUMBER: PMZ390UNEYL  [DFN1006_3NB]  (hidden comment: SINGLE)
MOS6_0  SINGLE  [SOT95P240X130_3NA]  (value not drawn)
MOS6_1  SINGLE  [SOT95P240X130_3NA]  (value not drawn)
MOS7_0  SINGLE  [SOT95P240X130_3NA]  (value not drawn)
MOS7_1  SINGLE  [SOT95P240X130_3NA]  (value not drawn)
MOS8_0  SINGLE  [SOT95P240X130_3NA]  (value not drawn)
MOS8_1  SINGLE  [SOT95P240X130_3NA]  (value not drawn)
R1_0  0 Ohm  BOM_IGNORE: TRUE  [RESC0603X33NB]
R1_1  0 Ohm  BOM_IGNORE: TRUE  [RESC0603X33NB]
R2_0  0 Ohm  [RESC1005X50NA]
R2_1  0 Ohm  [RESC1005X50NA]
R3_0  0 Ohm  BOM_IGNORE: TRUE  [RESC0603X33NB]
R3_1  0 Ohm  BOM_IGNORE: TRUE  [RESC0603X33NB]
R4_0  0 Ohm  [RESC1005X50NA]
R4_1  0 Ohm  [RESC1005X50NA]
R5_0  10K Ohm  [RESC2012X70NA]
R5_1  10K Ohm  [RESC2012X70NA]
R6_0  10K Ohm  [RESC2012X70NA]
R6_1  10K Ohm  [RESC2012X70NA]
R7_0  10K Ohm  [RESC2012X70NA]
R7_1  10K Ohm  [RESC2012X70NA]
R8_0  10K Ohm  [RESC2012X70NA]
R8_1  10K Ohm  [RESC2012X70NA]
R9_0  10K Ohm  [RESC2012X70NA]
R9_1  10K Ohm  [RESC2012X70NA]
R10_0  10K Ohm  [RESC2012X70NA]
R10_1  10K Ohm  [RESC2012X70NA]
R11_0  10K Ohm  [RESC2012X70NA]
R11_1  10K Ohm  [RESC2012X70NA]
R12_0  10K Ohm  [RESC2012X70NA]
R12_1  10K Ohm  [RESC2012X70NA]

### Ports
C1_0 (in), C1_1 (in), C1_CTRL1_0 (in), C1_CTRL1_1 (in), C1_CTRL2_0 (in), C1_CTRL2_1 (in), C1_CTRL3_0 (in), C1_CTRL3_1 (in), C1_CTRL4_0 (in), C1_CTRL4_1 (in), C2_0 (in), C2_1 (in), C2_CTRL1_0 (in), C2_CTRL1_1 (in), C2_CTRL2_0 (in), C2_CTRL2_1 (in), C2_CTRL3_0 (in), C2_CTRL3_1 (in), C2_CTRL4_0 (in), C2_CTRL4_1 (in), CAL1 (in), P174_HSD6571_DIO00 (in), P174_HSD6571_DIO01 (in), P174_HSD6571_DIO08 (in), P174_HSD6571_DIO09 (in), P174_HSD6571_DIO10 (in), P174_HSD6571_DIO11 (in), P174_HSD6571_DIO12 (in), P174_HSD6571_DIO13 (in), P174_HSD6571_DIO14 (in), P174_HSD6571_DIO15 (in), P174_HSD6571_DIO16 (in), P174_HSD6571_DIO17 (in), P174_HSD6571_DIO24 (in), P174_HSD6571_DIO25 (in), P174_HSD6571_DIO26 (in), P174_HSD6571_DIO27 (in), P174_HSD6571_DIO28 (in), P174_HSD6571_DIO29 (in), P174_HSD6571_DIO30 (in), P174_HSD6571_DIO31 (in), RF1_0 (in), RF1_1 (in), RF2_0 (in), RF2_1 (in), RF3_0 (in), RF3_1 (in)

### Nets
GND: CAL1_A.2(GROUND) CAL1_B.2(GROUND) CON1_0.2(GROUND) CON1_1.2(GROUND) CON2_0.2(GROUND) CON2_1.2(GROUND) CON3_0.2(GROUND) CON3_1.2(GROUND) DUT_0.3(GND) DUT_0.7(E-GND1) DUT_0.8(E-GND2) DUT_1.3(GND) DUT_1.7(E-GND1) DUT_1.8(E-GND2) MOS1_0.2(S) MOS1_1.2(S) MOS2_0.2(S) MOS2_1.2(S) MOS3_0.2(S) MOS3_1.2(S) MOS4_0.2(S) MOS4_1.2(S) MOS5_0.2(S) MOS5_1.2(S) MOS6_0.2(S) MOS6_1.2(S) MOS7_0.2(S) MOS7_1.2(S) MOS8_0.2(S) MOS8_1.2(S) R1_0.2 R1_1.2 R3_0.2 R3_1.2 R5_0.2 R5_1.2 R6_0.2 R6_1.2 R7_0.2 R7_1.2 R8_0.2 R8_1.2 R9_0.2 R9_1.2 R10_0.2 R10_1.2 R11_0.2 R11_1.2 R12_0.2 R12_1.2
NetC1_0_1: C1_0.1 DUT_0.4(C1) R2_0.1 ; port C1_0, port P174_HSD6571_DIO00
NetC1_0_2: C1_0.2 MOS1_0.3(D) R1_0.1
NetC1_1_1: C1_1.1 DUT_1.4(C1) R2_1.1 ; port P174_HSD6571_DIO16, port C1_1
NetC1_1_2: C1_1.2 MOS1_1.3(D) R1_1.1
NetC2_0_1: C2_0.1 C3_0.1 C4_0.1 R2_0.2
NetC2_0_2: C2_0.2 MOS2_0.3(D)
NetC2_1_1: C2_1.1 C3_1.1 C4_1.1 R2_1.2
NetC2_1_2: C2_1.2 MOS2_1.3(D)
NetC3_0_2: C3_0.2 MOS3_0.3(D)
NetC3_1_2: C3_1.2 MOS3_1.3(D)
NetC4_0_2: C4_0.2 MOS4_0.3(D)
NetC4_1_2: C4_1.2 MOS4_1.3(D)
NetC5_0_1: C5_0.1 DUT_0.2(C2) R4_0.1 ; port P174_HSD6571_DIO01, port C2_0
NetC5_0_2: C5_0.2 MOS5_0.3(D) R3_0.1
NetC5_1_1: C5_1.1 DUT_1.2(C2) R4_1.1 ; port P174_HSD6571_DIO17, port C2_1
NetC5_1_2: C5_1.2 MOS5_1.3(D) R3_1.1
NetC6_0_1: C6_0.1 C7_0.1 C8_0.1 R4_0.2
NetC6_0_2: C6_0.2 MOS6_0.3(D)
NetC6_1_1: C6_1.1 C7_1.1 C8_1.1 R4_1.2
NetC6_1_2: C6_1.2 MOS6_1.3(D)
NetC7_0_2: C7_0.2 MOS7_0.3(D)
NetC7_1_2: C7_1.2 MOS7_1.3(D)
NetC8_0_2: C8_0.2 MOS8_0.3(D)
NetC8_1_2: C8_1.2 MOS8_1.3(D)
NetCAL1_A_1: CAL1_A.1 CAL1_B.1 ; port CAL1
NetCON1_0_1: CON1_0.1 DUT_0.1(RF1) ; port RF1_0
NetCON1_1_1: CON1_1.1 DUT_1.1(RF1) ; port RF1_1
NetCON2_0_1: CON2_0.1 DUT_0.6(RF2) ; port RF2_0
NetCON2_1_1: CON2_1.1 DUT_1.6(RF2) ; port RF2_1
NetCON3_0_1: CON3_0.1 DUT_0.5(RF3) ; port RF3_0
NetCON3_1_1: CON3_1.1 DUT_1.5(RF3) ; port RF3_1
NetMOS1_0_1: MOS1_0.1(G) ; port C1_CTRL1_0
NetMOS1_1_1: MOS1_1.1(G) R5_1.1 ; port P174_HSD6571_DIO24, port C1_CTRL1_1
NetMOS2_0_1: MOS2_0.1(G) R6_0.1 ; port P174_HSD6571_DIO09, port C1_CTRL2_0
NetMOS2_1_1: MOS2_1.1(G) R6_1.1 ; port P174_HSD6571_DIO25, port C1_CTRL2_1
NetMOS3_0_1: MOS3_0.1(G) ; port C1_CTRL3_0
NetMOS3_1_1: MOS3_1.1(G) ; port C1_CTRL3_1
NetMOS4_0_1: MOS4_0.1(G) ; port C1_CTRL4_0
NetMOS4_1_1: MOS4_1.1(G) ; port C1_CTRL4_1
NetMOS5_0_1: MOS5_0.1(G) R9_0.1 ; port P174_HSD6571_DIO12, port C2_CTRL1_0
NetMOS5_1_1: MOS5_1.1(G) R9_1.1 ; port P174_HSD6571_DIO28, port C2_CTRL1_1
NetMOS6_0_1: MOS6_0.1(G) ; port C2_CTRL2_0
NetMOS6_1_1: MOS6_1.1(G) ; port C2_CTRL2_1
NetMOS7_0_1: MOS7_0.1(G) ; port C2_CTRL3_0
NetMOS7_1_1: MOS7_1.1(G) ; port C2_CTRL3_1
NetMOS8_0_1: MOS8_0.1(G) ; port C2_CTRL4_0
NetMOS8_1_1: MOS8_1.1(G) ; port C2_CTRL4_1
NetP174_C1: R10_1.1 ; port P174_HSD6571_DIO29
NetP174_C3: R11_0.1 ; port P174_HSD6571_DIO14
NetP174_C7: R7_0.1 ; port P174_HSD6571_DIO10
NetP174_C9: R5_0.1 ; port P174_HSD6571_DIO08
NetP174_D2: R12_0.1 ; port P174_HSD6571_DIO15
NetP174_D4: R10_0.1 ; port P174_HSD6571_DIO13
NetP174_D6: R8_0.1 ; port P174_HSD6571_DIO11
NetP174_G3: R7_1.1 ; port P174_HSD6571_DIO26
NetP174_G5: R11_1.1 ; port P174_HSD6571_DIO30
NetP174_H2: R8_1.1 ; port P174_HSD6571_DIO27
NetP174_H4: R12_1.1 ; port P174_HSD6571_DIO31

### Notes on the sheet
- DUT_0 CIRCUIT
- (near C1_0) Close to DUT pin
- (near MOS1_0) Close to C1 pin
- (near R1_0) Close to C1 pin
- Equal length RF1/RF2/RF3
- for all sites
- (near C5_0) Close to DUT pin
- (near MOS5_0) Close to C5 pin
- (near R3_0) Close to C5 pin
- DUT_1 CIRCUIT
- (near C1_1) Close to DUT pin
- (near MOS1_1) Close to C1 pin
- (near R1_1) Close to C1 pin
- (near C5_1) Close to DUT pin
- (near MOS5_1) Close to C5 pin
- (near R3_1) Close to C5 pin
- Test/Calibration structures
- Test structures are double the length of the RF lines with the same via and routing strategy required (for de-embedding)
- Net CAL1 is doubled the length of nets RF1, RF2 and RF3 (consistent across all sites)
- (in symbol 29976sm_2_001) SMP
- (in symbol HE_DEFAULT) www.harbor-electronics.com; TITLE:; PROJECT:; DEVICE:; PROJECT NO:; SHEET NAME:; DESIGNER:; ENGINEER:; SO NUMBER:; CONTROL NUMBER:; REV:; VER:; CONFIDENTIAL: THIS DOCUMENT CONTAINS INFORMATION WHICH IS THE PROPERTY OF; HARBOR ELECTRONICS, INC. THIS DOCUMENT IS RECEIVED IN CONFIDENCE AND ITS CONTENTS MAY NOT; SHEET:; OF:; BE DISCLOSED OR REPRODUCED WITHOUT THE PRIOR WRITTEN CONSENT OF HARBOR ELECTRONICS, INC.

### Library data of the parts
*#4 = HE_DEFAULT: as *#1 on sheet 01-TITLE
C1_0 C5_0 = capacitor: ALT_SYMBOLS: (CAPC1005X65N,CAPC1005X65N_NT,CAPC1005X65L,CAPC1005X65NA_HS); CLASS: DISCRETE; LIB_NAME: Capacitor; HEIGHT: 0.5 mm; PCB Footprint: CAPC1005X65NA
C1_1 C5_1 = capacitor: CLASS: DISCRETE; ALT_SYMBOLS: (CAPC1005X65N,CAPC1005X65N_NT,CAPC1005X65L,CAPC1005X65NA_HS); HEIGHT: 0.5 mm; LIB_NAME: Capacitor; PCB Footprint: CAPC1005X65NA
C2_0 C6_0 = capacitor: Cap Ceramic 50pF 100V C0G 1% Pad SMD 0805 125degC; PART_NUMBER: 08051A500FAT2A; MANUFACTURER: KYOCERA AVX Components Corporation; CLASS: DISCRETE; ALT_SYMBOLS: (CAPC2012X150N,CAPC2012X150L); LIB_NAME: z_Capacitor_Individual; HEIGHT: 0.94 mm; PCB Footprint: CAPC2012X150NA
C2_1 C6_1 = capacitor: Cap Ceramic 50pF 100V C0G 1% Pad SMD 0805 125degC; MANUFACTURER: KYOCERA AVX Components Corporation; PART_NUMBER: 08051A500FAT2A; LIB_NAME: z_Capacitor_Individual; ALT_SYMBOLS: (CAPC2012X150N,CAPC2012X150L); CLASS: DISCRETE; HEIGHT: 0.94 mm; PCB Footprint: CAPC2012X150NA
C3_0 C7_0 = capacitor: CLASS: DISCRETE; ALT_SYMBOLS: (CAPC2012X150N,CAPC2012X150L); HEIGHT: 0.94(Max) mm; LIB_NAME: Capacitor; PCB Footprint: CAPC2012X150NA
C3_1 C7_1 = capacitor: ALT_SYMBOLS: (CAPC2012X150N,CAPC2012X150L); CLASS: DISCRETE; LIB_NAME: Capacitor; HEIGHT: 0.94(Max) mm; PCB Footprint: CAPC2012X150NA
C4_0 C8_1 = capacitor: Cap Ceramic 200pF 50V C0G 1% Pad SMD 0805 125degC; PART_NUMBER: 08055A201FAT2A; MANUFACTURER: KYOCERA AVX Components Corporation; CLASS: DISCRETE; ALT_SYMBOLS: (CAPC2012X150N,CAPC2012X150L); LIB_NAME: z_Capacitor_Individual; HEIGHT: 0.94 mm; PCB Footprint: CAPC2012X150NA
C4_1 C8_0 = capacitor: Cap Ceramic 200pF 50V C0G 1% Pad SMD 0805 125degC; MANUFACTURER: KYOCERA AVX Components Corporation; PART_NUMBER: 08055A201FAT2A; LIB_NAME: z_Capacitor_Individual; ALT_SYMBOLS: (CAPC2012X150N,CAPC2012X150L); CLASS: DISCRETE; HEIGHT: 0.94 mm; PCB Footprint: CAPC2012X150NA
CAL1_A CAL1_B CON1_0 CON1_1 = 29976sm_2_001: RF Coaxial Connectors; LIB_NAME: z_Connector_Individual; ALT_SYMBOLS: (HUBER_SUHNER_29976SM_2_001N,HUBER_SUHNER_29976SM_2_001_OPT1); CLASS: IC; PCB Footprint: HUBER_SUHNER_29976SM_2_001NA; HEIGHT: 5.237 MM
CON2_0 CON2_1 CON3_0 CON3_1 = 29976sm_2_001: RF Coaxial Connectors; CLASS: IC; ALT_SYMBOLS: (HUBER_SUHNER_29976SM_2_001N,HUBER_SUHNER_29976SM_2_001_OPT1); LIB_NAME: z_Connector_Individual; PCB Footprint: HUBER_SUHNER_29976SM_2_001NA; HEIGHT: 5.237 MM
MOS1_0 MOS5_1 = pmz390une: Trans MOSFET N-CH 30V 0.9A 3-Pin DFN; MANUFACTURER: Nexperia; CLASS: IC; ALT_SYMBOLS: (DFN1006_3N); LIB_NAME: z_Transistor_Individual; HEIGHT: 0.50 MM; PCB Footprint: DFN1006_3NB
MOS1_1 MOS5_0 = pmz390une: Trans MOSFET N-CH 30V 0.9A 3-Pin DFN; MANUFACTURER: Nexperia; LIB_NAME: z_Transistor_Individual; ALT_SYMBOLS: (DFN1006_3N); CLASS: IC; HEIGHT: 0.50 MM; PCB Footprint: DFN1006_3NB
MOS2_0 MOS3_1 MOS4_1 MOS6_0 MOS7_1 MOS8_1 = bss138akar: Trans MOSFET N-CH 60V 0.2A Automotive AEC-Q101 3-Pin SOT-23; MANUFACTURER: Nexperia; LIB_NAME: z_Transistor_Individual; ALT_SYMBOLS: (SOT95P240X130_3N); CLASS: IC; PART_NUMBER: BSS138AKAR; HEIGHT: 1.10 MM; PCB Footprint: SOT95P240X130_3NA
MOS2_1 MOS3_0 MOS4_0 MOS6_1 MOS7_0 MOS8_0 = bss138akar: Trans MOSFET N-CH 60V 0.2A Automotive AEC-Q101 3-Pin SOT-23; MANUFACTURER: Nexperia; CLASS: IC; ALT_SYMBOLS: (SOT95P240X130_3N); LIB_NAME: z_Transistor_Individual; HEIGHT: 1.10 MM; PART_NUMBER: BSS138AKAR; PCB Footprint: SOT95P240X130_3NA
R1_0 R1_1 R3_0 R3_1 = resistor: CLASS: DISCRETE; ALT_SYMBOLS: (RESC0603X33N,RESC0603X33L); AML_PN: 775-1493-00; PCB Footprint: RESC0603X33NB; HEIGHT: 0.23 mm; LIB_NAME: Resistor
R2_0 R4_1 = resistor: CLASS: DISCRETE; ALT_SYMBOLS: (RESC1005X60N_NTA;RESC1005X50N;RESC1005X50NA_HS;RESC1005X60L); AML_PN: 775-0014-00; HEIGHT: 0.35 mm; LIB_NAME: Resistor; PCB Footprint: RESC1005X50NA
R2_1 R4_0 = resistor: AML_PN: 775-0014-00; ALT_SYMBOLS: (RESC1005X60N_NTA;RESC1005X50N;RESC1005X50NA_HS;RESC1005X60L); CLASS: DISCRETE; LIB_NAME: Resistor; HEIGHT: 0.35 mm; PCB Footprint: RESC1005X50NA
R5_0 R6_0 R7_0 R8_0 R9_0 R10_0 R11_0 R12_0 = resistor: Res Thick Film 0805 10K Ohm 0.5% 0.5W(1/2W) +/-100ppm/degC Pad SMD  Automotive AEC-Q200; MANUFACTURER: Panasonic; PART_NUMBER: ERJHP6D1002V; LIB_NAME: z_Resistor_Individual; AML_PN: 775-2282-00-01; ALT_SYMBOLS: (RESC2012X70N,RESC2012X84L); CLASS: DISCRETE; HEIGHT: 0.70 mm; PCB Footprint: RESC2012X70NA
R5_1 R6_1 R7_1 R8_1 R9_1 R10_1 R11_1 R12_1 = resistor: Res Thick Film 0805 10K Ohm 0.5% 0.5W(1/2W) +/-100ppm/degC Pad SMD  Automotive AEC-Q200; PART_NUMBER: ERJHP6D1002V; MANUFACTURER: Panasonic; CLASS: DISCRETE; ALT_SYMBOLS: (RESC2012X70N,RESC2012X84L); AML_PN: 775-2282-00-01; LIB_NAME: z_Resistor_Individual; HEIGHT: 0.70 mm; PCB Footprint: RESC2012X70NA
DUT_0 DUT_1 = M6225A: PCB Footprint: dut_302149803

## Sheet 05-DUT2-3.SchDoc
size 594 x 420 mm
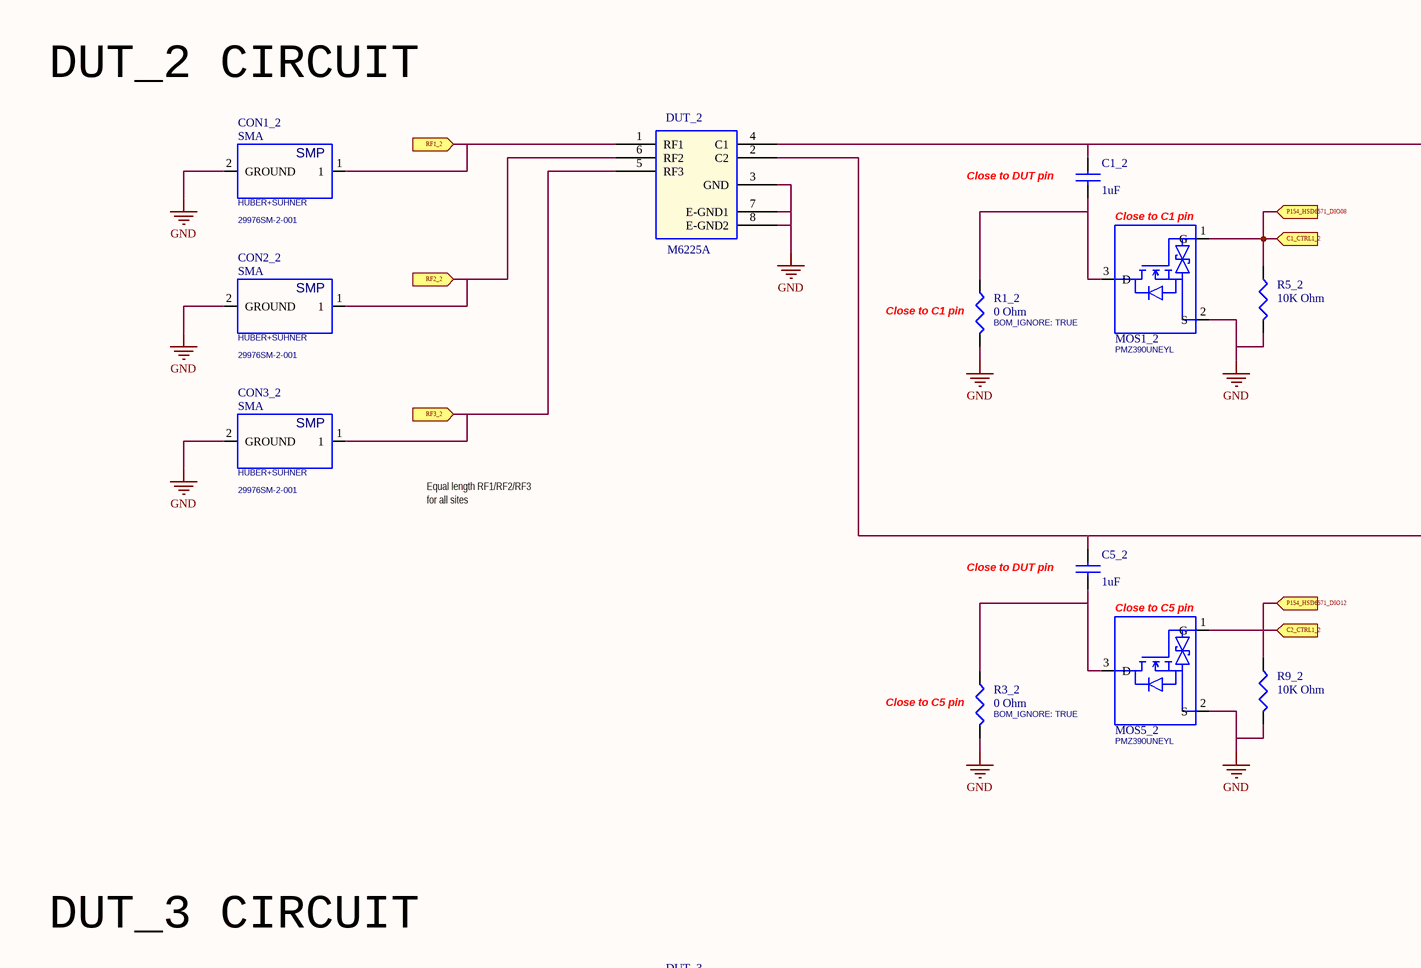
[diagram p14: 05-DUT2-3.SchDoc, top left]
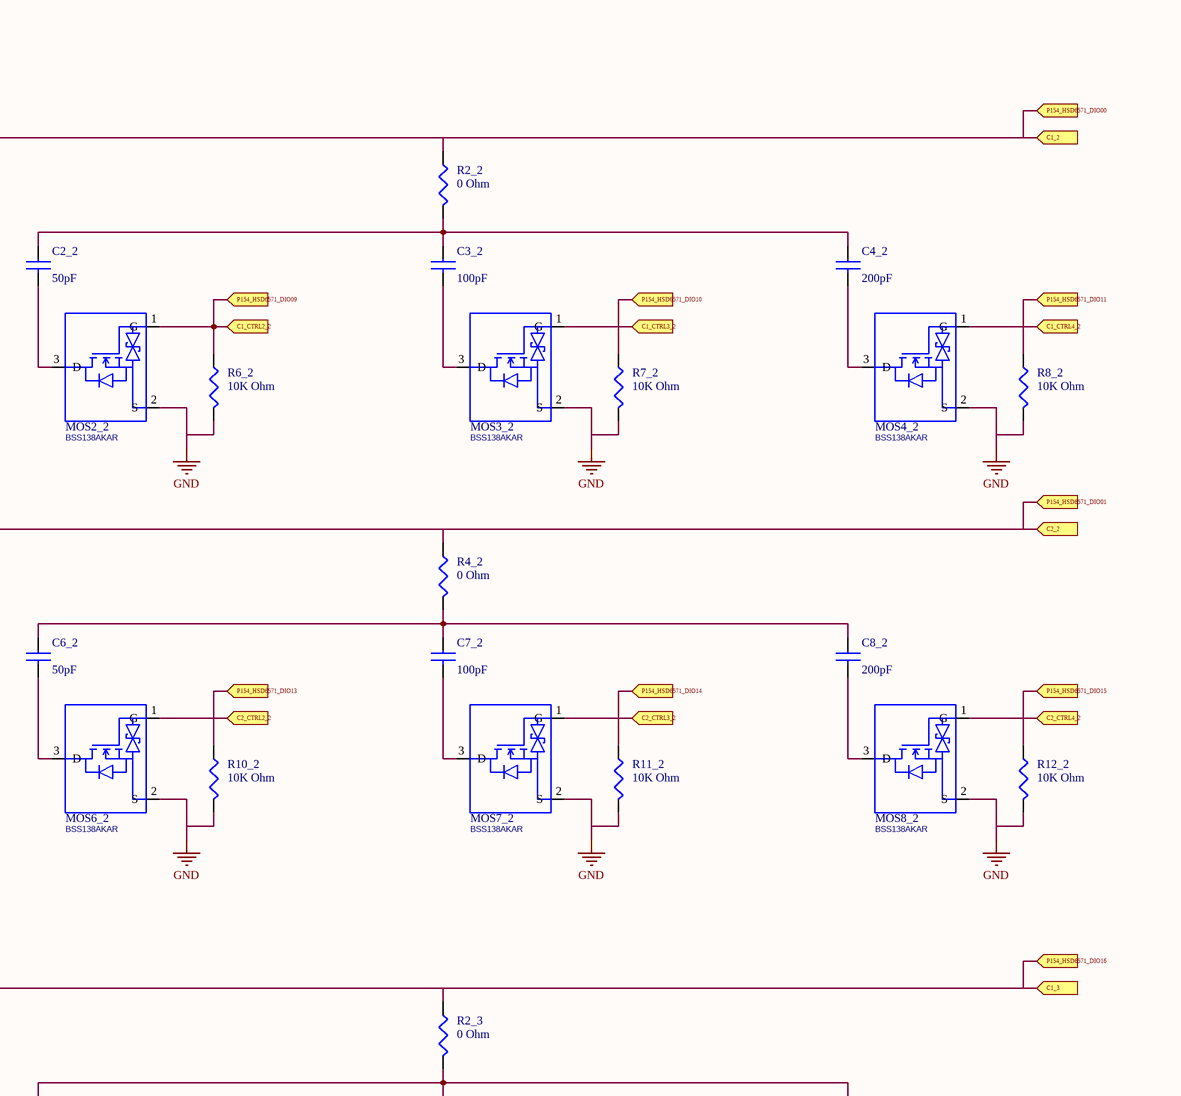
[diagram p15: 05-DUT2-3.SchDoc, top right]
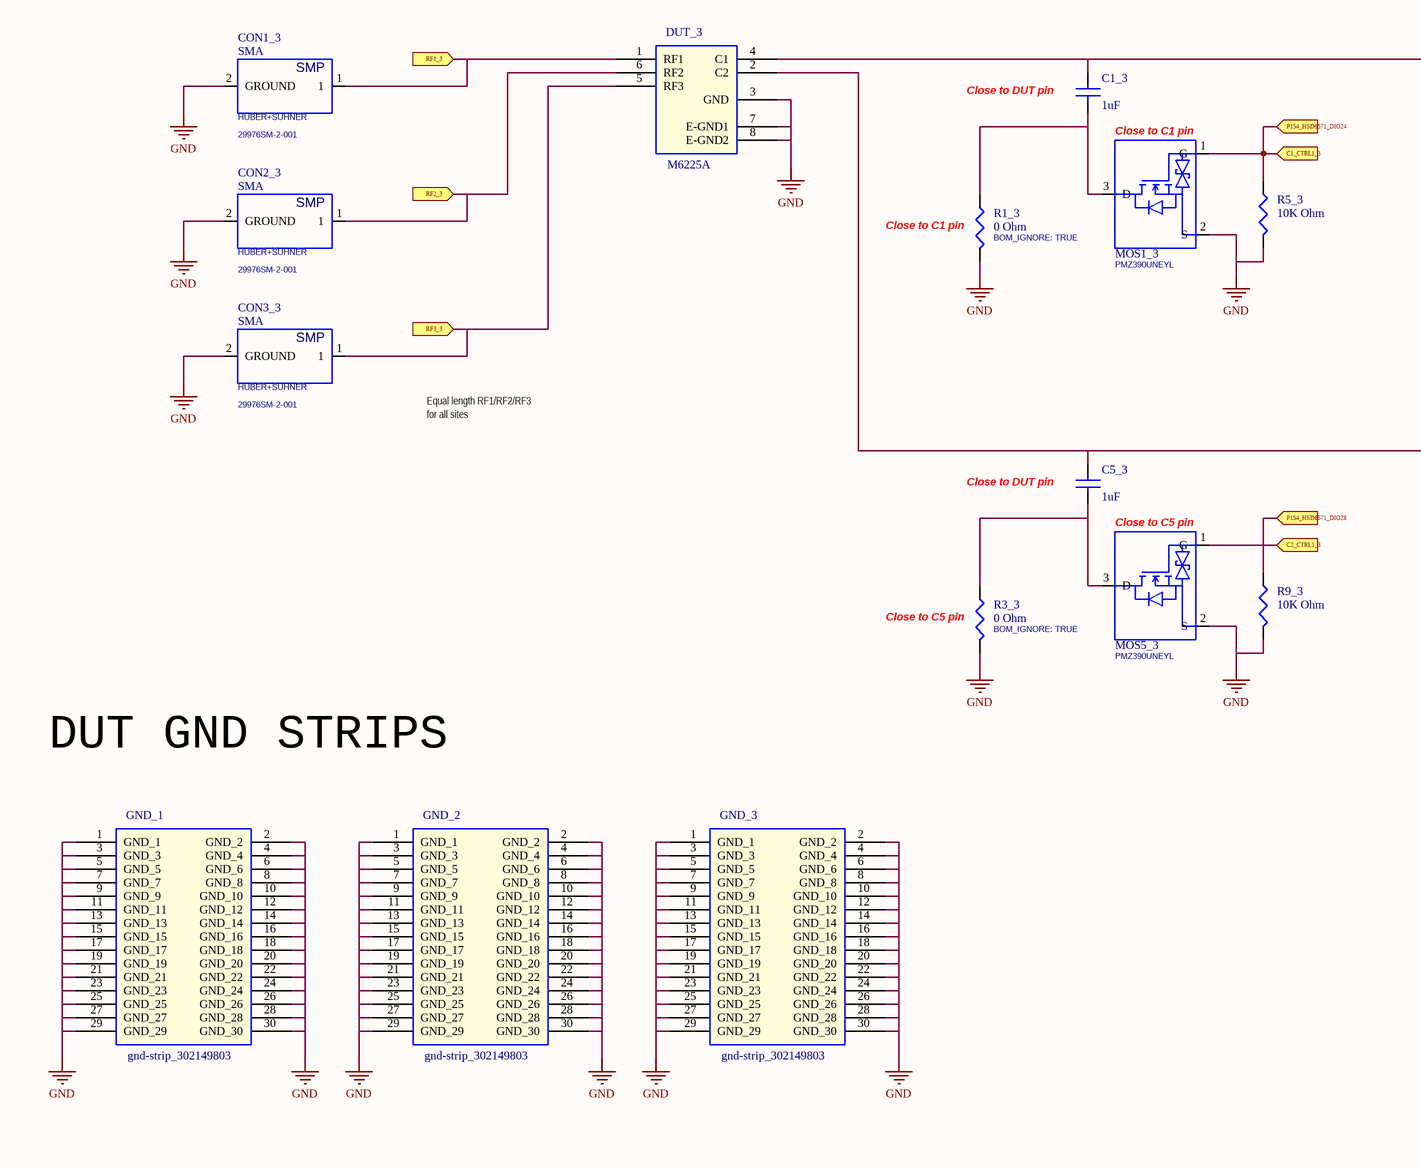
[diagram p16: 05-DUT2-3.SchDoc, bottom left]
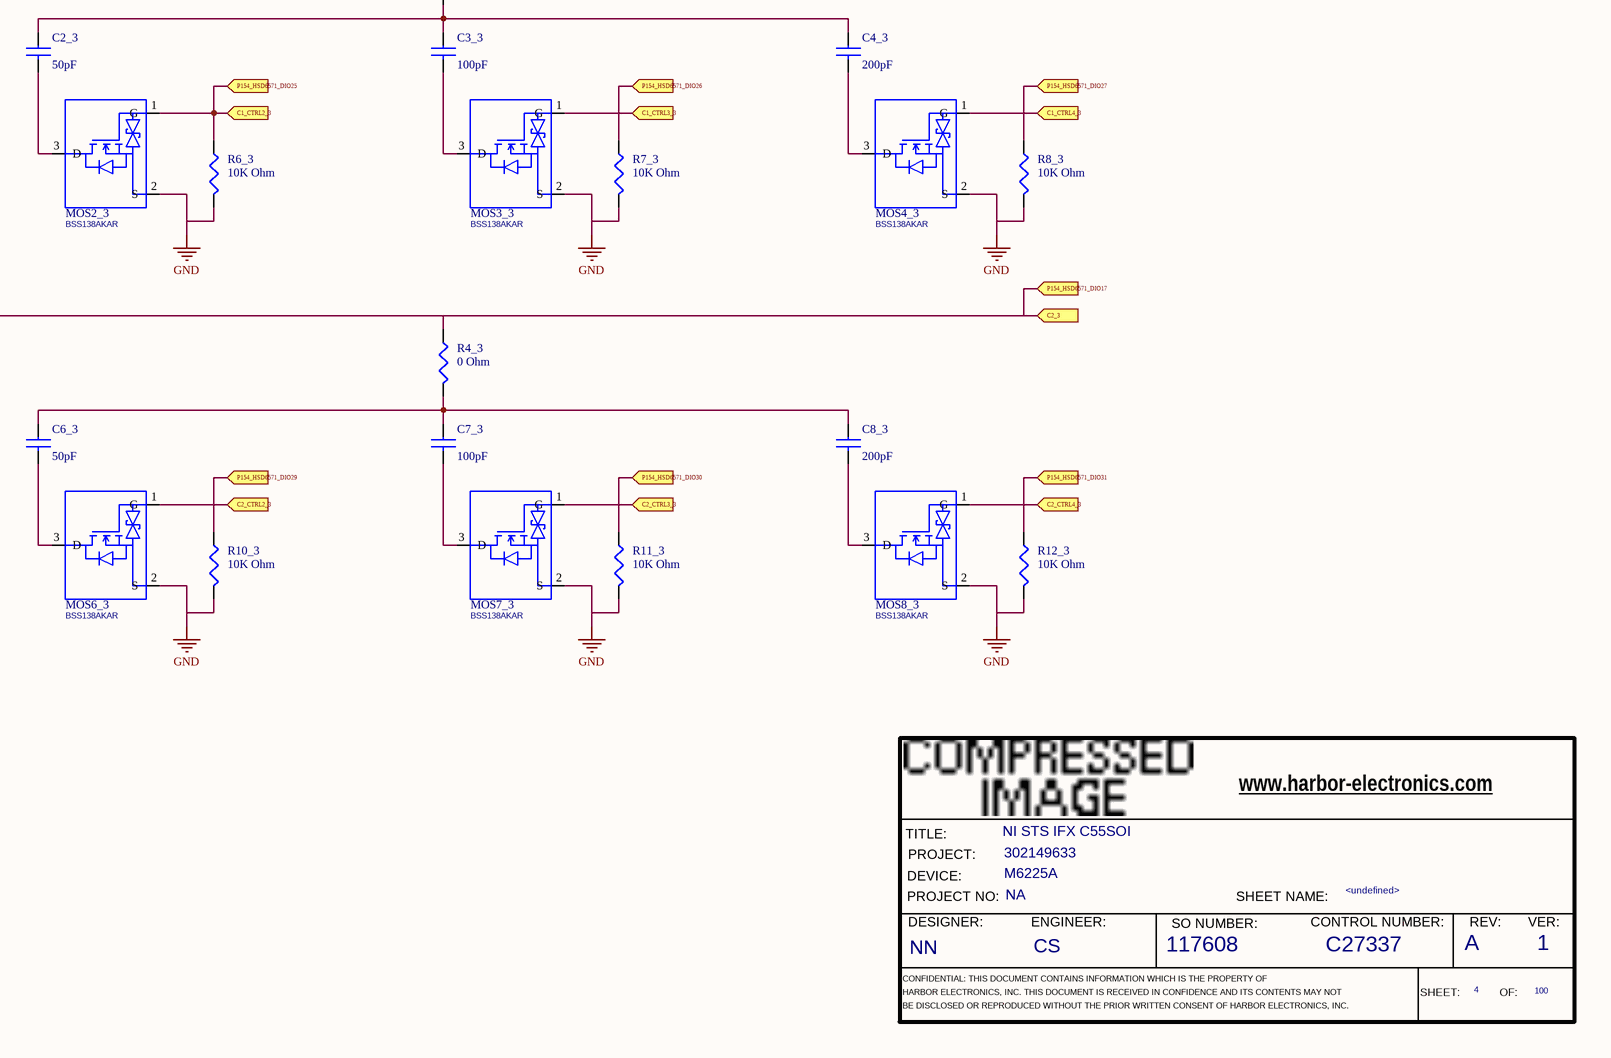
[diagram p17: 05-DUT2-3.SchDoc, bottom right]

### Parts
(Parts that share a designator on the sheet are numbered #1, #2 ... from top to bottom, then left to right.)
*#5  RevCode: A  Title: NI STS IFX C55SOI  Page Number: 4  Page Count: 100  Engineer: CS  Designer: NN  SO Number: 117608  Control Number: C27337  Version: 1  Page Name: <undefined>  PROJECT: 302149633  DEVICE: M6225A  PROJECT NO.: NA  (hidden comment: HE_DEFAULT)  (graphical)
C1_2  1uF  [CAPC1005X65NA]
C1_3  1uF  [CAPC1005X65NA]
C2_2  50pF  [CAPC2012X150NA]
C2_3  50pF  [CAPC2012X150NA]
C3_2  100pF  [CAPC2012X150NA]
C3_3  100pF  [CAPC2012X150NA]
C4_2  200pF  [CAPC2012X150NA]
C4_3  200pF  [CAPC2012X150NA]
C5_2  1uF  [CAPC1005X65NA]
C5_3  1uF  [CAPC1005X65NA]
C6_2  50pF  [CAPC2012X150NA]
C6_3  50pF  [CAPC2012X150NA]
C7_2  100pF  [CAPC2012X150NA]
C7_3  100pF  [CAPC2012X150NA]
C8_2  200pF  [CAPC2012X150NA]
C8_3  200pF  [CAPC2012X150NA]
CON1_2  SMA  PART_NUMBER: 29976SM-2-001  MANUFACTURER: HUBER+SUHNER  [HUBER_SUHNER_29976SM_2_001NA]
CON1_3  SMA  PART_NUMBER: 29976SM-2-001  MANUFACTURER: HUBER+SUHNER  [HUBER_SUHNER_29976SM_2_001NA]
CON2_2  SMA  MANUFACTURER: HUBER+SUHNER  PART_NUMBER: 29976SM-2-001  [HUBER_SUHNER_29976SM_2_001NA]
CON2_3  SMA  MANUFACTURER: HUBER+SUHNER  PART_NUMBER: 29976SM-2-001  [HUBER_SUHNER_29976SM_2_001NA]
CON3_2  SMA  MANUFACTURER: HUBER+SUHNER  PART_NUMBER: 29976SM-2-001  [HUBER_SUHNER_29976SM_2_001NA]
CON3_3  SMA  MANUFACTURER: HUBER+SUHNER  PART_NUMBER: 29976SM-2-001  [HUBER_SUHNER_29976SM_2_001NA]
DUT_2  M6225A  [dut_302149803]
DUT_3  M6225A  [dut_302149803]
GND_1  gnd-strip_302149803  [gnd-strip_302149803]
GND_2  gnd-strip_302149803  [gnd-strip_302149803]
GND_3  gnd-strip_302149803  [gnd-strip_302149803]
MOS1_2  PART_NUMBER: PMZ390UNEYL  [DFN1006_3NB]  (hidden comment: SINGLE)
MOS1_3  PART_NUMBER: PMZ390UNEYL  [DFN1006_3NB]  (hidden comment: SINGLE)
MOS2_2  SINGLE  [SOT95P240X130_3NA]  (value not drawn)
MOS2_3  SINGLE  [SOT95P240X130_3NA]  (value not drawn)
MOS3_2  SINGLE  [SOT95P240X130_3NA]  (value not drawn)
MOS3_3  SINGLE  [SOT95P240X130_3NA]  (value not drawn)
MOS4_2  SINGLE  [SOT95P240X130_3NA]  (value not drawn)
MOS4_3  SINGLE  [SOT95P240X130_3NA]  (value not drawn)
MOS5_2  PART_NUMBER: PMZ390UNEYL  [DFN1006_3NB]  (hidden comment: SINGLE)
MOS5_3  PART_NUMBER: PMZ390UNEYL  [DFN1006_3NB]  (hidden comment: SINGLE)
MOS6_2  SINGLE  [SOT95P240X130_3NA]  (value not drawn)
MOS6_3  SINGLE  [SOT95P240X130_3NA]  (value not drawn)
MOS7_2  SINGLE  [SOT95P240X130_3NA]  (value not drawn)
MOS7_3  SINGLE  [SOT95P240X130_3NA]  (value not drawn)
MOS8_2  SINGLE  [SOT95P240X130_3NA]  (value not drawn)
MOS8_3  SINGLE  [SOT95P240X130_3NA]  (value not drawn)
R1_2  0 Ohm  BOM_IGNORE: TRUE  [RESC0603X33NB]
R1_3  0 Ohm  BOM_IGNORE: TRUE  [RESC0603X33NB]
R2_2  0 Ohm  [RESC1005X50NA]
R2_3  0 Ohm  [RESC1005X50NA]
R3_2  0 Ohm  BOM_IGNORE: TRUE  [RESC0603X33NB]
R3_3  0 Ohm  BOM_IGNORE: TRUE  [RESC0603X33NB]
R4_2  0 Ohm  [RESC1005X50NA]
R4_3  0 Ohm  [RESC1005X50NA]
R5_2  10K Ohm  [RESC2012X70NA]
R5_3  10K Ohm  [RESC2012X70NA]
R6_2  10K Ohm  [RESC2012X70NA]
R6_3  10K Ohm  [RESC2012X70NA]
R7_2  10K Ohm  [RESC2012X70NA]
R7_3  10K Ohm  [RESC2012X70NA]
R8_2  10K Ohm  [RESC2012X70NA]
R8_3  10K Ohm  [RESC2012X70NA]
R9_2  10K Ohm  [RESC2012X70NA]
R9_3  10K Ohm  [RESC2012X70NA]
R10_2  10K Ohm  [RESC2012X70NA]
R10_3  10K Ohm  [RESC2012X70NA]
R11_2  10K Ohm  [RESC2012X70NA]
R11_3  10K Ohm  [RESC2012X70NA]
R12_2  10K Ohm  [RESC2012X70NA]
R12_3  10K Ohm  [RESC2012X70NA]

### Ports
C1_2 (in), C1_3 (in), C1_CTRL1_2 (in), C1_CTRL1_3 (in), C1_CTRL2_2 (in), C1_CTRL2_3 (in), C1_CTRL3_2 (in), C1_CTRL3_3 (in), C1_CTRL4_2 (in), C1_CTRL4_3 (in), C2_2 (in), C2_3 (in), C2_CTRL1_2 (in), C2_CTRL1_3 (in), C2_CTRL2_2 (in), C2_CTRL2_3 (in), C2_CTRL3_2 (in), C2_CTRL3_3 (in), C2_CTRL4_2 (in), C2_CTRL4_3 (in), P154_HSD6571_DIO00 (in), P154_HSD6571_DIO01 (in), P154_HSD6571_DIO08 (in), P154_HSD6571_DIO09 (in), P154_HSD6571_DIO10 (in), P154_HSD6571_DIO11 (in), P154_HSD6571_DIO12 (in), P154_HSD6571_DIO13 (in), P154_HSD6571_DIO14 (in), P154_HSD6571_DIO15 (in), P154_HSD6571_DIO16 (in), P154_HSD6571_DIO17 (in), P154_HSD6571_DIO24 (in), P154_HSD6571_DIO25 (in), P154_HSD6571_DIO26 (in), P154_HSD6571_DIO27 (in), P154_HSD6571_DIO28 (in), P154_HSD6571_DIO29 (in), P154_HSD6571_DIO30 (in), P154_HSD6571_DIO31 (in), RF1_2 (in), RF1_3 (in), RF2_2 (in), RF2_3 (in), RF3_2 (in), RF3_3 (in)

### Nets
GND: CON1_2.2(GROUND) CON1_3.2(GROUND) CON2_2.2(GROUND) CON2_3.2(GROUND) CON3_2.2(GROUND) CON3_3.2(GROUND) DUT_2.3(GND) DUT_2.7(E-GND1) DUT_2.8(E-GND2) DUT_3.3(GND) DUT_3.7(E-GND1) DUT_3.8(E-GND2) GND_1.1(GND_1) GND_1.2(GND_2) GND_1.3(GND_3) GND_1.4(GND_4) GND_1.5(GND_5) GND_1.6(GND_6) GND_1.7(GND_7) GND_1.8(GND_8) GND_1.9(GND_9) GND_1.10(GND_10) GND_1.11(GND_11) GND_1.12(GND_12) GND_1.13(GND_13) GND_1.14(GND_14) GND_1.15(GND_15) GND_1.16(GND_16) GND_1.17(GND_17) GND_1.18(GND_18) GND_1.19(GND_19) GND_1.20(GND_20) GND_1.21(GND_21) GND_1.22(GND_22) GND_1.23(GND_23) GND_1.24(GND_24) GND_1.25(GND_25) GND_1.26(GND_26) GND_1.27(GND_27) GND_1.28(GND_28) GND_1.29(GND_29) GND_1.30(GND_30) GND_2.1(GND_1) GND_2.2(GND_2) GND_2.3(GND_3) GND_2.4(GND_4) GND_2.5(GND_5) GND_2.6(GND_6) GND_2.7(GND_7) GND_2.8(GND_8) GND_2.9(GND_9) GND_2.10(GND_10) GND_2.11(GND_11) GND_2.12(GND_12) GND_2.13(GND_13) GND_2.14(GND_14) GND_2.15(GND_15) GND_2.16(GND_16) GND_2.17(GND_17) GND_2.18(GND_18) GND_2.19(GND_19) GND_2.20(GND_20) GND_2.21(GND_21) GND_2.22(GND_22) GND_2.23(GND_23) GND_2.24(GND_24) GND_2.25(GND_25) GND_2.26(GND_26) GND_2.27(GND_27) GND_2.28(GND_28) GND_2.29(GND_29) GND_2.30(GND_30) GND_3.1(GND_1) GND_3.2(GND_2) GND_3.3(GND_3) GND_3.4(GND_4) GND_3.5(GND_5) GND_3.6(GND_6) GND_3.7(GND_7) GND_3.8(GND_8) GND_3.9(GND_9) GND_3.10(GND_10) GND_3.11(GND_11) GND_3.12(GND_12) GND_3.13(GND_13) GND_3.14(GND_14) GND_3.15(GND_15) GND_3.16(GND_16) GND_3.17(GND_17) GND_3.18(GND_18) GND_3.19(GND_19) GND_3.20(GND_20) GND_3.21(GND_21) GND_3.22(GND_22) GND_3.23(GND_23) GND_3.24(GND_24) GND_3.25(GND_25) GND_3.26(GND_26) GND_3.27(GND_27) GND_3.28(GND_28) GND_3.29(GND_29) GND_3.30(GND_30) MOS1_2.2(S) MOS1_3.2(S) MOS2_2.2(S) MOS2_3.2(S) MOS3_2.2(S) MOS3_3.2(S) MOS4_2.2(S) MOS4_3.2(S) MOS5_2.2(S) MOS5_3.2(S) MOS6_2.2(S) MOS6_3.2(S) MOS7_2.2(S) MOS7_3.2(S) MOS8_2.2(S) MOS8_3.2(S) R1_2.2 R1_3.2 R3_2.2 R3_3.2 R5_2.2 R5_3.2 R6_2.2 R6_3.2 R7_2.2 R7_3.2 R8_2.2 R8_3.2 R9_2.2 R9_3.2 R10_2.2 R10_3.2 R11_2.2 R11_3.2 R12_2.2 R12_3.2
NetC1_2_1: C1_2.1 DUT_2.4(C1) R2_2.1 ; port P154_HSD6571_DIO00, port C1_2
NetC1_2_2: C1_2.2 MOS1_2.3(D) R1_2.1
NetC1_3_1: C1_3.1 DUT_3.4(C1) R2_3.1 ; port P154_HSD6571_DIO16, port C1_3
NetC1_3_2: C1_3.2 MOS1_3.3(D) R1_3.1
NetC2_2_1: C2_2.1 C3_2.1 C4_2.1 R2_2.2
NetC2_2_2: C2_2.2 MOS2_2.3(D)
NetC2_3_1: C2_3.1 C3_3.1 C4_3.1 R2_3.2
NetC2_3_2: C2_3.2 MOS2_3.3(D)
NetC3_2_2: C3_2.2 MOS3_2.3(D)
NetC3_3_2: C3_3.2 MOS3_3.3(D)
NetC4_2_2: C4_2.2 MOS4_2.3(D)
NetC4_3_2: C4_3.2 MOS4_3.3(D)
NetC5_2_1: C5_2.1 DUT_2.2(C2) R4_2.1 ; port P154_HSD6571_DIO01, port C2_2
NetC5_2_2: C5_2.2 MOS5_2.3(D) R3_2.1
NetC5_3_1: C5_3.1 DUT_3.2(C2) R4_3.1 ; port P154_HSD6571_DIO17, port C2_3
NetC5_3_2: C5_3.2 MOS5_3.3(D) R3_3.1
NetC6_2_1: C6_2.1 C7_2.1 C8_2.1 R4_2.2
NetC6_2_2: C6_2.2 MOS6_2.3(D)
NetC6_3_1: C6_3.1 C7_3.1 C8_3.1 R4_3.2
NetC6_3_2: C6_3.2 MOS6_3.3(D)
NetC7_2_2: C7_2.2 MOS7_2.3(D)
NetC7_3_2: C7_3.2 MOS7_3.3(D)
NetC8_2_2: C8_2.2 MOS8_2.3(D)
NetC8_3_2: C8_3.2 MOS8_3.3(D)
NetCON1_2_1: CON1_2.1 DUT_2.1(RF1) ; port RF1_2
NetCON1_3_1: CON1_3.1 DUT_3.1(RF1) ; port RF1_3
NetCON2_2_1: CON2_2.1 DUT_2.6(RF2) ; port RF2_2
NetCON2_3_1: CON2_3.1 DUT_3.6(RF2) ; port RF2_3
NetCON3_2_1: CON3_2.1 DUT_2.5(RF3) ; port RF3_2
NetCON3_3_1: CON3_3.1 DUT_3.5(RF3) ; port RF3_3
NetMOS1_2_1: MOS1_2.1(G) R5_2.1 ; port P154_HSD6571_DIO08, port C1_CTRL1_2
NetMOS1_3_1: MOS1_3.1(G) R5_3.1 ; port P154_HSD6571_DIO24, port C1_CTRL1_3
NetMOS2_2_1: MOS2_2.1(G) R6_2.1 ; port P154_HSD6571_DIO09, port C1_CTRL2_2
NetMOS2_3_1: MOS2_3.1(G) R6_3.1 ; port P154_HSD6571_DIO25, port C1_CTRL2_3
NetMOS3_2_1: MOS3_2.1(G) ; port C1_CTRL3_2
NetMOS3_3_1: MOS3_3.1(G) ; port C1_CTRL3_3
NetMOS4_2_1: MOS4_2.1(G) ; port C1_CTRL4_2
NetMOS4_3_1: MOS4_3.1(G) ; port C1_CTRL4_3
NetMOS5_2_1: MOS5_2.1(G) ; port C2_CTRL1_2
NetMOS5_3_1: MOS5_3.1(G) ; port C2_CTRL1_3
NetMOS6_2_1: MOS6_2.1(G) ; port C2_CTRL2_2
NetMOS6_3_1: MOS6_3.1(G) ; port C2_CTRL2_3
NetMOS7_2_1: MOS7_2.1(G) ; port C2_CTRL3_2
NetMOS7_3_1: MOS7_3.1(G) ; port C2_CTRL3_3
NetMOS8_2_1: MOS8_2.1(G) ; port C2_CTRL4_2
NetMOS8_3_1: MOS8_3.1(G) ; port C2_CTRL4_3
NetP154_A1: R9_3.1 ; port P154_HSD6571_DIO28
NetP154_C1: R10_3.1 ; port P154_HSD6571_DIO29
NetP154_C3: R11_2.1 ; port P154_HSD6571_DIO14
NetP154_C5: R9_2.1 ; port P154_HSD6571_DIO12
NetP154_C7: R7_2.1 ; port P154_HSD6571_DIO10
NetP154_D2: R12_2.1 ; port P154_HSD6571_DIO15
NetP154_D4: R10_2.1 ; port P154_HSD6571_DIO13
NetP154_D6: R8_2.1 ; port P154_HSD6571_DIO11
NetP154_G3: R7_3.1 ; port P154_HSD6571_DIO26
NetP154_G5: R11_3.1 ; port P154_HSD6571_DIO30
NetP154_H2: R8_3.1 ; port P154_HSD6571_DIO27
NetP154_H4: R12_3.1 ; port P154_HSD6571_DIO31

### Notes on the sheet
- DUT_2 CIRCUIT
- (near C1_2) Close to DUT pin
- (near MOS1_2) Close to C1 pin
- (near R1_2) Close to C1 pin
- Equal length RF1/RF2/RF3
- for all sites
- (near C5_2) Close to DUT pin
- (near MOS5_2) Close to C5 pin
- (near R3_2) Close to C5 pin
- DUT_3 CIRCUIT
- (near C1_3) Close to DUT pin
- (near MOS1_3) Close to C1 pin
- (near R1_3) Close to C1 pin
- (near C5_3) Close to DUT pin
- (near MOS5_3) Close to C5 pin
- (near R3_3) Close to C5 pin
- DUT GND STRIPS
- (in symbol 29976sm_2_001) SMP
- (in symbol HE_DEFAULT) www.harbor-electronics.com; TITLE:; PROJECT:; DEVICE:; PROJECT NO:; SHEET NAME:; DESIGNER:; ENGINEER:; SO NUMBER:; CONTROL NUMBER:; REV:; VER:; CONFIDENTIAL: THIS DOCUMENT CONTAINS INFORMATION WHICH IS THE PROPERTY OF; HARBOR ELECTRONICS, INC. THIS DOCUMENT IS RECEIVED IN CONFIDENCE AND ITS CONTENTS MAY NOT; SHEET:; OF:; BE DISCLOSED OR REPRODUCED WITHOUT THE PRIOR WRITTEN CONSENT OF HARBOR ELECTRONICS, INC.

### Library data of the parts
*#5 = HE_DEFAULT: as *#1 on sheet 01-TITLE
C1_2 C5_2 = capacitor: as C1_0 on sheet 04-DUT0-1; PCB Footprint: CAPC1005X65NA; LIB_NAME: Capacitor; HEIGHT: 0.5 mm
C1_3 C5_3 = capacitor: as C1_1 on sheet 04-DUT0-1; PCB Footprint: CAPC1005X65NA; HEIGHT: 0.5 mm; LIB_NAME: Capacitor
C2_2 C6_2 = capacitor: as C2_0 on sheet 04-DUT0-1; PCB Footprint: CAPC2012X150NA; HEIGHT: 0.94 mm
C2_3 C6_3 = capacitor: as C2_1 on sheet 04-DUT0-1; PCB Footprint: CAPC2012X150NA; HEIGHT: 0.94 mm
C3_2 C7_2 = capacitor: as C3_0 on sheet 04-DUT0-1; PCB Footprint: CAPC2012X150NA; HEIGHT: 0.94(Max) mm; LIB_NAME: Capacitor
C3_3 C7_3 = capacitor: as C3_1 on sheet 04-DUT0-1; PCB Footprint: CAPC2012X150NA; LIB_NAME: Capacitor; HEIGHT: 0.94(Max) mm
C4_2 C8_3 = capacitor: as C4_0 on sheet 04-DUT0-1; PCB Footprint: CAPC2012X150NA; HEIGHT: 0.94 mm
C4_3 C8_2 = capacitor: as C4_1 on sheet 04-DUT0-1; PCB Footprint: CAPC2012X150NA; HEIGHT: 0.94 mm
CON1_2 CON1_3 = 29976sm_2_001: as CON2_0 on sheet 04-DUT0-1; PCB Footprint: HUBER_SUHNER_29976SM_2_001NA; HEIGHT: 5.237 MM
CON2_2 CON2_3 CON3_2 CON3_3 = 29976sm_2_001: as CAL1_A on sheet 04-DUT0-1; PCB Footprint: HUBER_SUHNER_29976SM_2_001NA; HEIGHT: 5.237 MM
MOS1_2 MOS1_3 MOS5_2 = pmz390une: as MOS1_1 on sheet 04-DUT0-1; HEIGHT: 0.50 MM; PCB Footprint: DFN1006_3NB
MOS2_2 MOS3_3 MOS4_3 MOS6_2 MOS7_3 MOS8_3 = bss138akar: as MOS2_0 on sheet 04-DUT0-1; PCB Footprint: SOT95P240X130_3NA; PART_NUMBER: BSS138AKAR; HEIGHT: 1.10 MM
MOS2_3 MOS3_2 MOS4_2 MOS6_3 MOS7_2 MOS8_2 = bss138akar: as MOS2_1 on sheet 04-DUT0-1; PCB Footprint: SOT95P240X130_3NA; HEIGHT: 1.10 MM; PART_NUMBER: BSS138AKAR
MOS5_3 = pmz390une: as MOS1_0 on sheet 04-DUT0-1; HEIGHT: 0.50 MM; PCB Footprint: DFN1006_3NB
R1_2 R1_3 R3_2 R3_3 = resistor: AML_PN: 775-1493-00; ALT_SYMBOLS: (RESC0603X33N,RESC0603X33L); CLASS: DISCRETE; LIB_NAME: Resistor; HEIGHT: 0.23 mm; PCB Footprint: RESC0603X33NB
R2_2 R4_3 = resistor: as R2_0 on sheet 04-DUT0-1; PCB Footprint: RESC1005X50NA; HEIGHT: 0.35 mm; LIB_NAME: Resistor
R2_3 R4_2 = resistor: as R2_1 on sheet 04-DUT0-1; PCB Footprint: RESC1005X50NA; LIB_NAME: Resistor; HEIGHT: 0.35 mm
R5_2 R6_2 R7_2 R8_2 R9_2 R10_2 R11_2 R12_2 = resistor: as R5_0 on sheet 04-DUT0-1; PCB Footprint: RESC2012X70NA; HEIGHT: 0.70 mm
R5_3 R6_3 R7_3 R8_3 R9_3 R10_3 R11_3 R12_3 = resistor: as R5_1 on sheet 04-DUT0-1; PCB Footprint: RESC2012X70NA; HEIGHT: 0.70 mm
DUT_2 DUT_3 = M6225A: PCB Footprint: dut_302149803
GND_1-GND_3 = gnd-strip_302149803: PCB Footprint: gnd-strip_302149803

## Sheet 40-DIGITAL.SchDoc
size 594 x 420 mm
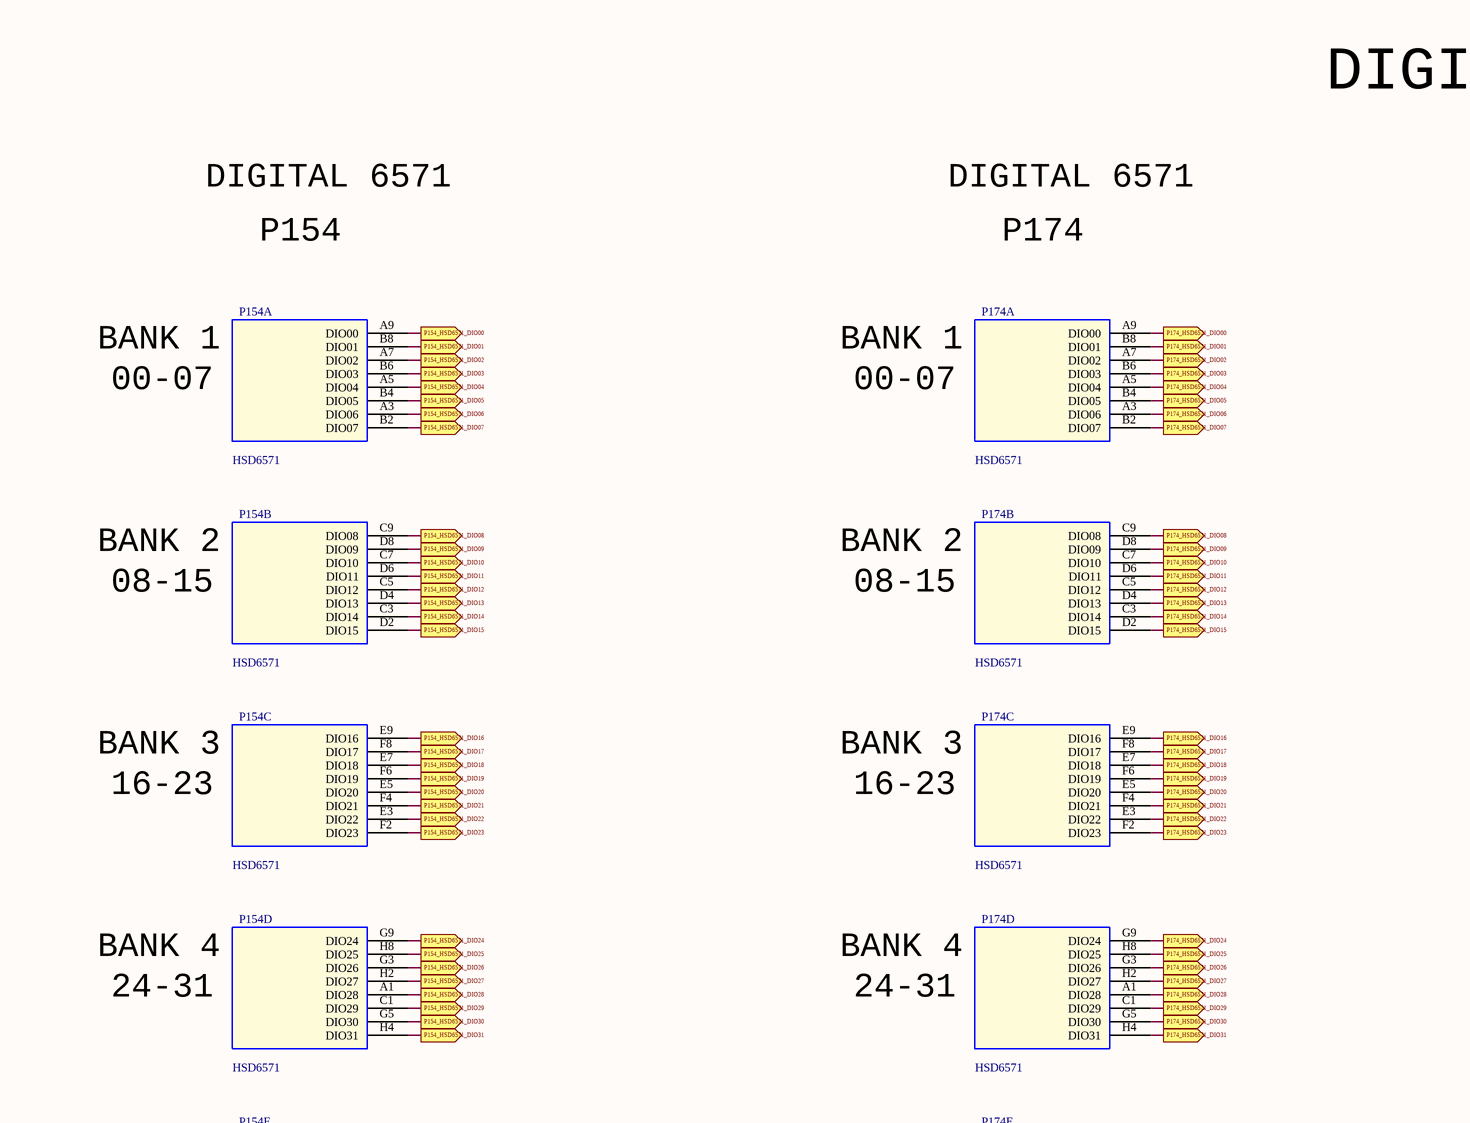
[diagram p18: 40-DIGITAL.SchDoc, top left]
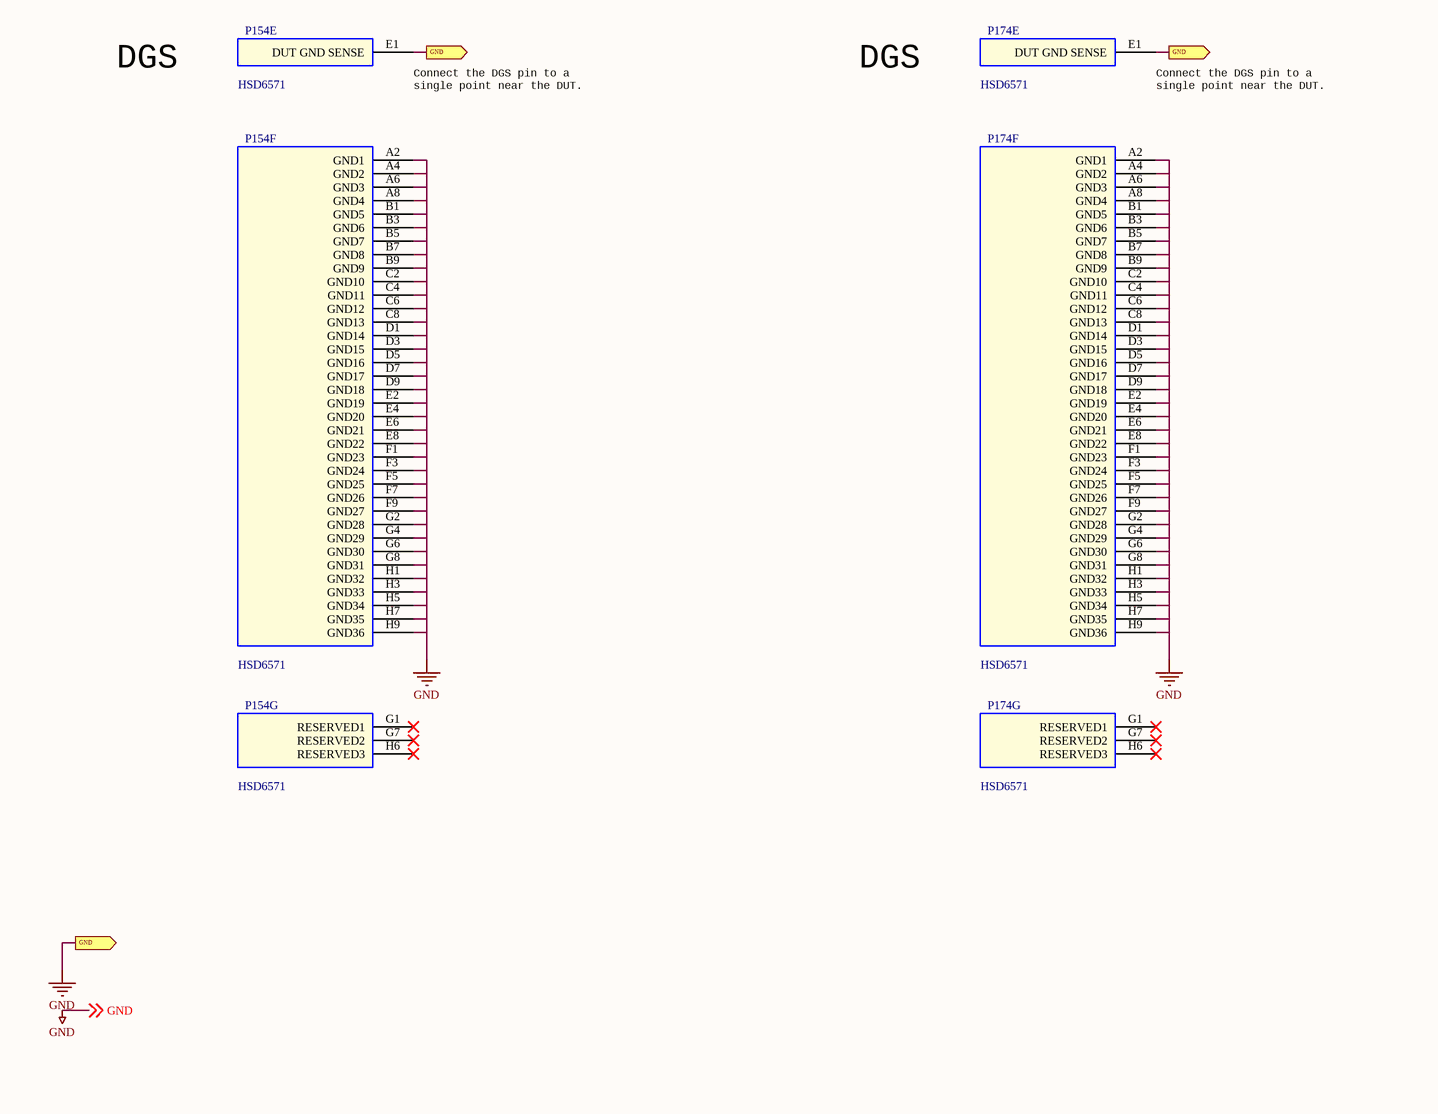
[diagram p19: 40-DIGITAL.SchDoc, bottom left]
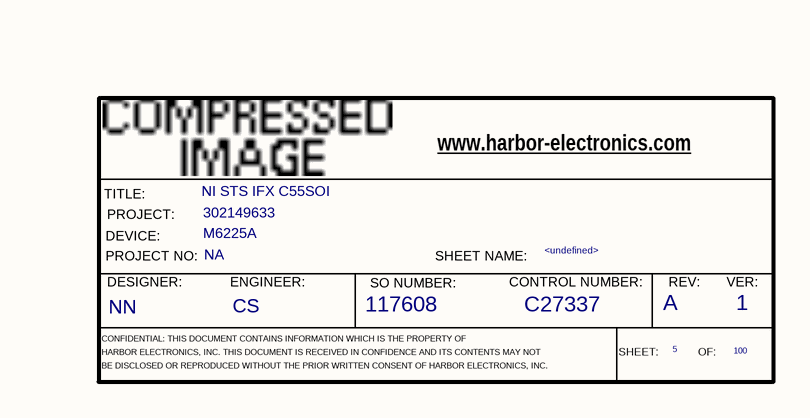
[diagram p20: 40-DIGITAL.SchDoc, bottom right]

### Parts
(Parts that share a designator on the sheet are numbered #1, #2 ... from top to bottom, then left to right.)
*#6  RevCode: A  Title: NI STS IFX C55SOI  Page Number: 5  Page Count: 100  Engineer: CS  Designer: NN  SO Number: 117608  Control Number: C27337  Version: 1  Page Name: <undefined>  PROJECT: 302149633  DEVICE: M6225A  PROJECT NO.: NA  (hidden comment: HE_DEFAULT)  (graphical)
P154  HSD6571  [285092A-08_72PIN]  (parts A,B,C,D,E,F,G of 7)
P174  HSD6571  [285092A-08_72PIN]  (parts A,B,C,D,E,F,G of 7)

### Ports
GND (out), P154_HSD6571_DIO00 (out), P154_HSD6571_DIO01 (out), P154_HSD6571_DIO02 (out), P154_HSD6571_DIO03 (out), P154_HSD6571_DIO04 (out), P154_HSD6571_DIO05 (out), P154_HSD6571_DIO06 (out), P154_HSD6571_DIO07 (out), P154_HSD6571_DIO08 (out), P154_HSD6571_DIO09 (out), P154_HSD6571_DIO10 (out), P154_HSD6571_DIO11 (out), P154_HSD6571_DIO12 (out), P154_HSD6571_DIO13 (out), P154_HSD6571_DIO14 (out), P154_HSD6571_DIO15 (out), P154_HSD6571_DIO16 (out), P154_HSD6571_DIO17 (out), P154_HSD6571_DIO18 (out), P154_HSD6571_DIO19 (out), P154_HSD6571_DIO20 (out), P154_HSD6571_DIO21 (out), P154_HSD6571_DIO22 (out), P154_HSD6571_DIO23 (out), P154_HSD6571_DIO24 (out), P154_HSD6571_DIO25 (out), P154_HSD6571_DIO26 (out), P154_HSD6571_DIO27 (out), P154_HSD6571_DIO28 (out), P154_HSD6571_DIO29 (out), P154_HSD6571_DIO30 (out), P154_HSD6571_DIO31 (out), P174_HSD6571_DIO00 (out), P174_HSD6571_DIO01 (out), P174_HSD6571_DIO02 (out), P174_HSD6571_DIO03 (out), P174_HSD6571_DIO04 (out), P174_HSD6571_DIO05 (out), P174_HSD6571_DIO06 (out), P174_HSD6571_DIO07 (out), P174_HSD6571_DIO08 (out), P174_HSD6571_DIO09 (out), P174_HSD6571_DIO10 (out), P174_HSD6571_DIO11 (out), P174_HSD6571_DIO12 (out), P174_HSD6571_DIO13 (out), P174_HSD6571_DIO14 (out), P174_HSD6571_DIO15 (out), P174_HSD6571_DIO16 (out), P174_HSD6571_DIO17 (out), P174_HSD6571_DIO18 (out), P174_HSD6571_DIO19 (out), P174_HSD6571_DIO20 (out), P174_HSD6571_DIO21 (out), P174_HSD6571_DIO22 (out), P174_HSD6571_DIO23 (out), P174_HSD6571_DIO24 (out), P174_HSD6571_DIO25 (out), P174_HSD6571_DIO26 (out), P174_HSD6571_DIO27 (out), P174_HSD6571_DIO28 (out), P174_HSD6571_DIO29 (out), P174_HSD6571_DIO30 (out), P174_HSD6571_DIO31 (out)

### Nets
GND: P154.A2(GND1) P154.A4(GND2) P154.A6(GND3) P154.A8(GND4) P154.B1(GND5) P154.B3(GND6) P154.B5(GND7) P154.B7(GND8) P154.B9(GND9) P154.C2(GND10) P154.C4(GND11) P154.C6(GND12) P154.C8(GND13) P154.D1(GND14) P154.D3(GND15) P154.D5(GND16) P154.D7(GND17) P154.D9(GND18) P154.E1(DUT_GND_SENSE) P154.E2(GND19) P154.E4(GND20) P154.E6(GND21) P154.E8(GND22) P154.F1(GND23) P154.F3(GND24) P154.F5(GND25) P154.F7(GND26) P154.F9(GND27) P154.G2(GND28) P154.G4(GND29) P154.G6(GND30) P154.G8(GND31) P154.H1(GND32) P154.H3(GND33) P154.H5(GND34) P154.H7(GND35) P154.H9(GND36) P174.A2(GND1) P174.A4(GND2) P174.A6(GND3) P174.A8(GND4) P174.B1(GND5) P174.B3(GND6) P174.B5(GND7) P174.B7(GND8) P174.B9(GND9) P174.C2(GND10) P174.C4(GND11) P174.C6(GND12) P174.C8(GND13) P174.D1(GND14) P174.D3(GND15) P174.D5(GND16) P174.D7(GND17) P174.D9(GND18) P174.E1(DUT_GND_SENSE) P174.E2(GND19) P174.E4(GND20) P174.E6(GND21) P174.E8(GND22) P174.F1(GND23) P174.F3(GND24) P174.F5(GND25) P174.F7(GND26) P174.F9(GND27) P174.G2(GND28) P174.G4(GND29) P174.G6(GND30) P174.G8(GND31) P174.H1(GND32) P174.H3(GND33) P174.H5(GND34) P174.H7(GND35) P174.H9(GND36) ; off-sheet GND, port GND
NetC1_0_1: P174.A9(DIO00) ; port P174_HSD6571_DIO00
NetC1_1_1: P174.E9(DIO16) ; port P174_HSD6571_DIO16
NetC1_2_1: P154.A9(DIO00) ; port P154_HSD6571_DIO00
NetC1_3_1: P154.E9(DIO16) ; port P154_HSD6571_DIO16
NetC5_0_1: P174.B8(DIO01) ; port P174_HSD6571_DIO01
NetC5_1_1: P174.F8(DIO17) ; port P174_HSD6571_DIO17
NetC5_2_1: P154.B8(DIO01) ; port P154_HSD6571_DIO01
NetC5_3_1: P154.F8(DIO17) ; port P154_HSD6571_DIO17
NetMOS1_1_1: P174.G9(DIO24) ; port P174_HSD6571_DIO24
NetMOS1_2_1: P154.C9(DIO08) ; port P154_HSD6571_DIO08
NetMOS1_3_1: P154.G9(DIO24) ; port P154_HSD6571_DIO24
NetMOS2_0_1: P174.D8(DIO09) ; port P174_HSD6571_DIO09
NetMOS2_1_1: P174.H8(DIO25) ; port P174_HSD6571_DIO25
NetMOS2_2_1: P154.D8(DIO09) ; port P154_HSD6571_DIO09
NetMOS2_3_1: P154.H8(DIO25) ; port P154_HSD6571_DIO25
NetMOS5_0_1: P174.C5(DIO12) ; port P174_HSD6571_DIO12
NetMOS5_1_1: P174.A1(DIO28) ; port P174_HSD6571_DIO28
NetP154_A1: P154.A1(DIO28) ; port P154_HSD6571_DIO28
NetP154_A3: P154.A3(DIO06) ; port P154_HSD6571_DIO06
NetP154_A5: P154.A5(DIO04) ; port P154_HSD6571_DIO04
NetP154_A7: P154.A7(DIO02) ; port P154_HSD6571_DIO02
NetP154_B2: P154.B2(DIO07) ; port P154_HSD6571_DIO07
NetP154_B4: P154.B4(DIO05) ; port P154_HSD6571_DIO05
NetP154_B6: P154.B6(DIO03) ; port P154_HSD6571_DIO03
NetP154_C1: P154.C1(DIO29) ; port P154_HSD6571_DIO29
NetP154_C3: P154.C3(DIO14) ; port P154_HSD6571_DIO14
NetP154_C5: P154.C5(DIO12) ; port P154_HSD6571_DIO12
NetP154_C7: P154.C7(DIO10) ; port P154_HSD6571_DIO10
NetP154_D2: P154.D2(DIO15) ; port P154_HSD6571_DIO15
NetP154_D4: P154.D4(DIO13) ; port P154_HSD6571_DIO13
NetP154_D6: P154.D6(DIO11) ; port P154_HSD6571_DIO11
NetP154_E3: P154.E3(DIO22) ; port P154_HSD6571_DIO22
NetP154_E5: P154.E5(DIO20) ; port P154_HSD6571_DIO20
NetP154_E7: P154.E7(DIO18) ; port P154_HSD6571_DIO18
NetP154_F2: P154.F2(DIO23) ; port P154_HSD6571_DIO23
NetP154_F4: P154.F4(DIO21) ; port P154_HSD6571_DIO21
NetP154_F6: P154.F6(DIO19) ; port P154_HSD6571_DIO19
NetP154_G3: P154.G3(DIO26) ; port P154_HSD6571_DIO26
NetP154_G5: P154.G5(DIO30) ; port P154_HSD6571_DIO30
NetP154_H2: P154.H2(DIO27) ; port P154_HSD6571_DIO27
NetP154_H4: P154.H4(DIO31) ; port P154_HSD6571_DIO31
NetP174_A3: P174.A3(DIO06) ; port P174_HSD6571_DIO06
NetP174_A5: P174.A5(DIO04) ; port P174_HSD6571_DIO04
NetP174_A7: P174.A7(DIO02) ; port P174_HSD6571_DIO02
NetP174_B2: P174.B2(DIO07) ; port P174_HSD6571_DIO07
NetP174_B4: P174.B4(DIO05) ; port P174_HSD6571_DIO05
NetP174_B6: P174.B6(DIO03) ; port P174_HSD6571_DIO03
NetP174_C1: P174.C1(DIO29) ; port P174_HSD6571_DIO29
NetP174_C3: P174.C3(DIO14) ; port P174_HSD6571_DIO14
NetP174_C7: P174.C7(DIO10) ; port P174_HSD6571_DIO10
NetP174_C9: P174.C9(DIO08) ; port P174_HSD6571_DIO08
NetP174_D2: P174.D2(DIO15) ; port P174_HSD6571_DIO15
NetP174_D4: P174.D4(DIO13) ; port P174_HSD6571_DIO13
NetP174_D6: P174.D6(DIO11) ; port P174_HSD6571_DIO11
NetP174_E3: P174.E3(DIO22) ; port P174_HSD6571_DIO22
NetP174_E5: P174.E5(DIO20) ; port P174_HSD6571_DIO20
NetP174_E7: P174.E7(DIO18) ; port P174_HSD6571_DIO18
NetP174_F2: P174.F2(DIO23) ; port P174_HSD6571_DIO23
NetP174_F4: P174.F4(DIO21) ; port P174_HSD6571_DIO21
NetP174_F6: P174.F6(DIO19) ; port P174_HSD6571_DIO19
NetP174_G3: P174.G3(DIO26) ; port P174_HSD6571_DIO26
NetP174_G5: P174.G5(DIO30) ; port P174_HSD6571_DIO30
NetP174_H2: P174.H2(DIO27) ; port P174_HSD6571_DIO27
NetP174_H4: P174.H4(DIO31) ; port P174_HSD6571_DIO31

Not connected (* = marked no-connect by the designer): P154 G1(RESERVED1)* G7(RESERVED2)* H6(RESERVED3)*; P174 G1(RESERVED1)* G7(RESERVED2)* H6(RESERVED3)*

### Notes on the sheet
- DIGITAL
- DIGITAL 6571
- P154
- P174
- BANK 1
- 00-07
- BANK 2
- 08-15
- BANK 3
- 16-23
- BANK 4
- 24-31
- DGS
- (near P154) Connect the DGS pin to a
  single point near the DUT.
- (near P174) Connect the DGS pin to a
  single point near the DUT.
- (in symbol HE_DEFAULT) www.harbor-electronics.com; TITLE:; PROJECT:; DEVICE:; PROJECT NO:; SHEET NAME:; DESIGNER:; ENGINEER:; SO NUMBER:; CONTROL NUMBER:; REV:; VER:; CONFIDENTIAL: THIS DOCUMENT CONTAINS INFORMATION WHICH IS THE PROPERTY OF; HARBOR ELECTRONICS, INC. THIS DOCUMENT IS RECEIVED IN CONFIDENCE AND ITS CONTENTS MAY NOT; SHEET:; OF:; BE DISCLOSED OR REPRODUCED WITHOUT THE PRIOR WRITTEN CONSENT OF HARBOR ELECTRONICS, INC.

### Library data of the parts
*#6 = HE_DEFAULT: as *#1 on sheet 01-TITLE
P154 P174 = HSD6571: SPLIT_INST: TRUE; SWAP_INFO: (S1+S2+S3+S4+S5+S6+S7); PCB Footprint: 285092A-08_72PIN

## Sheet 41-DIGITIZERS.SchDoc
size 594 x 420 mm
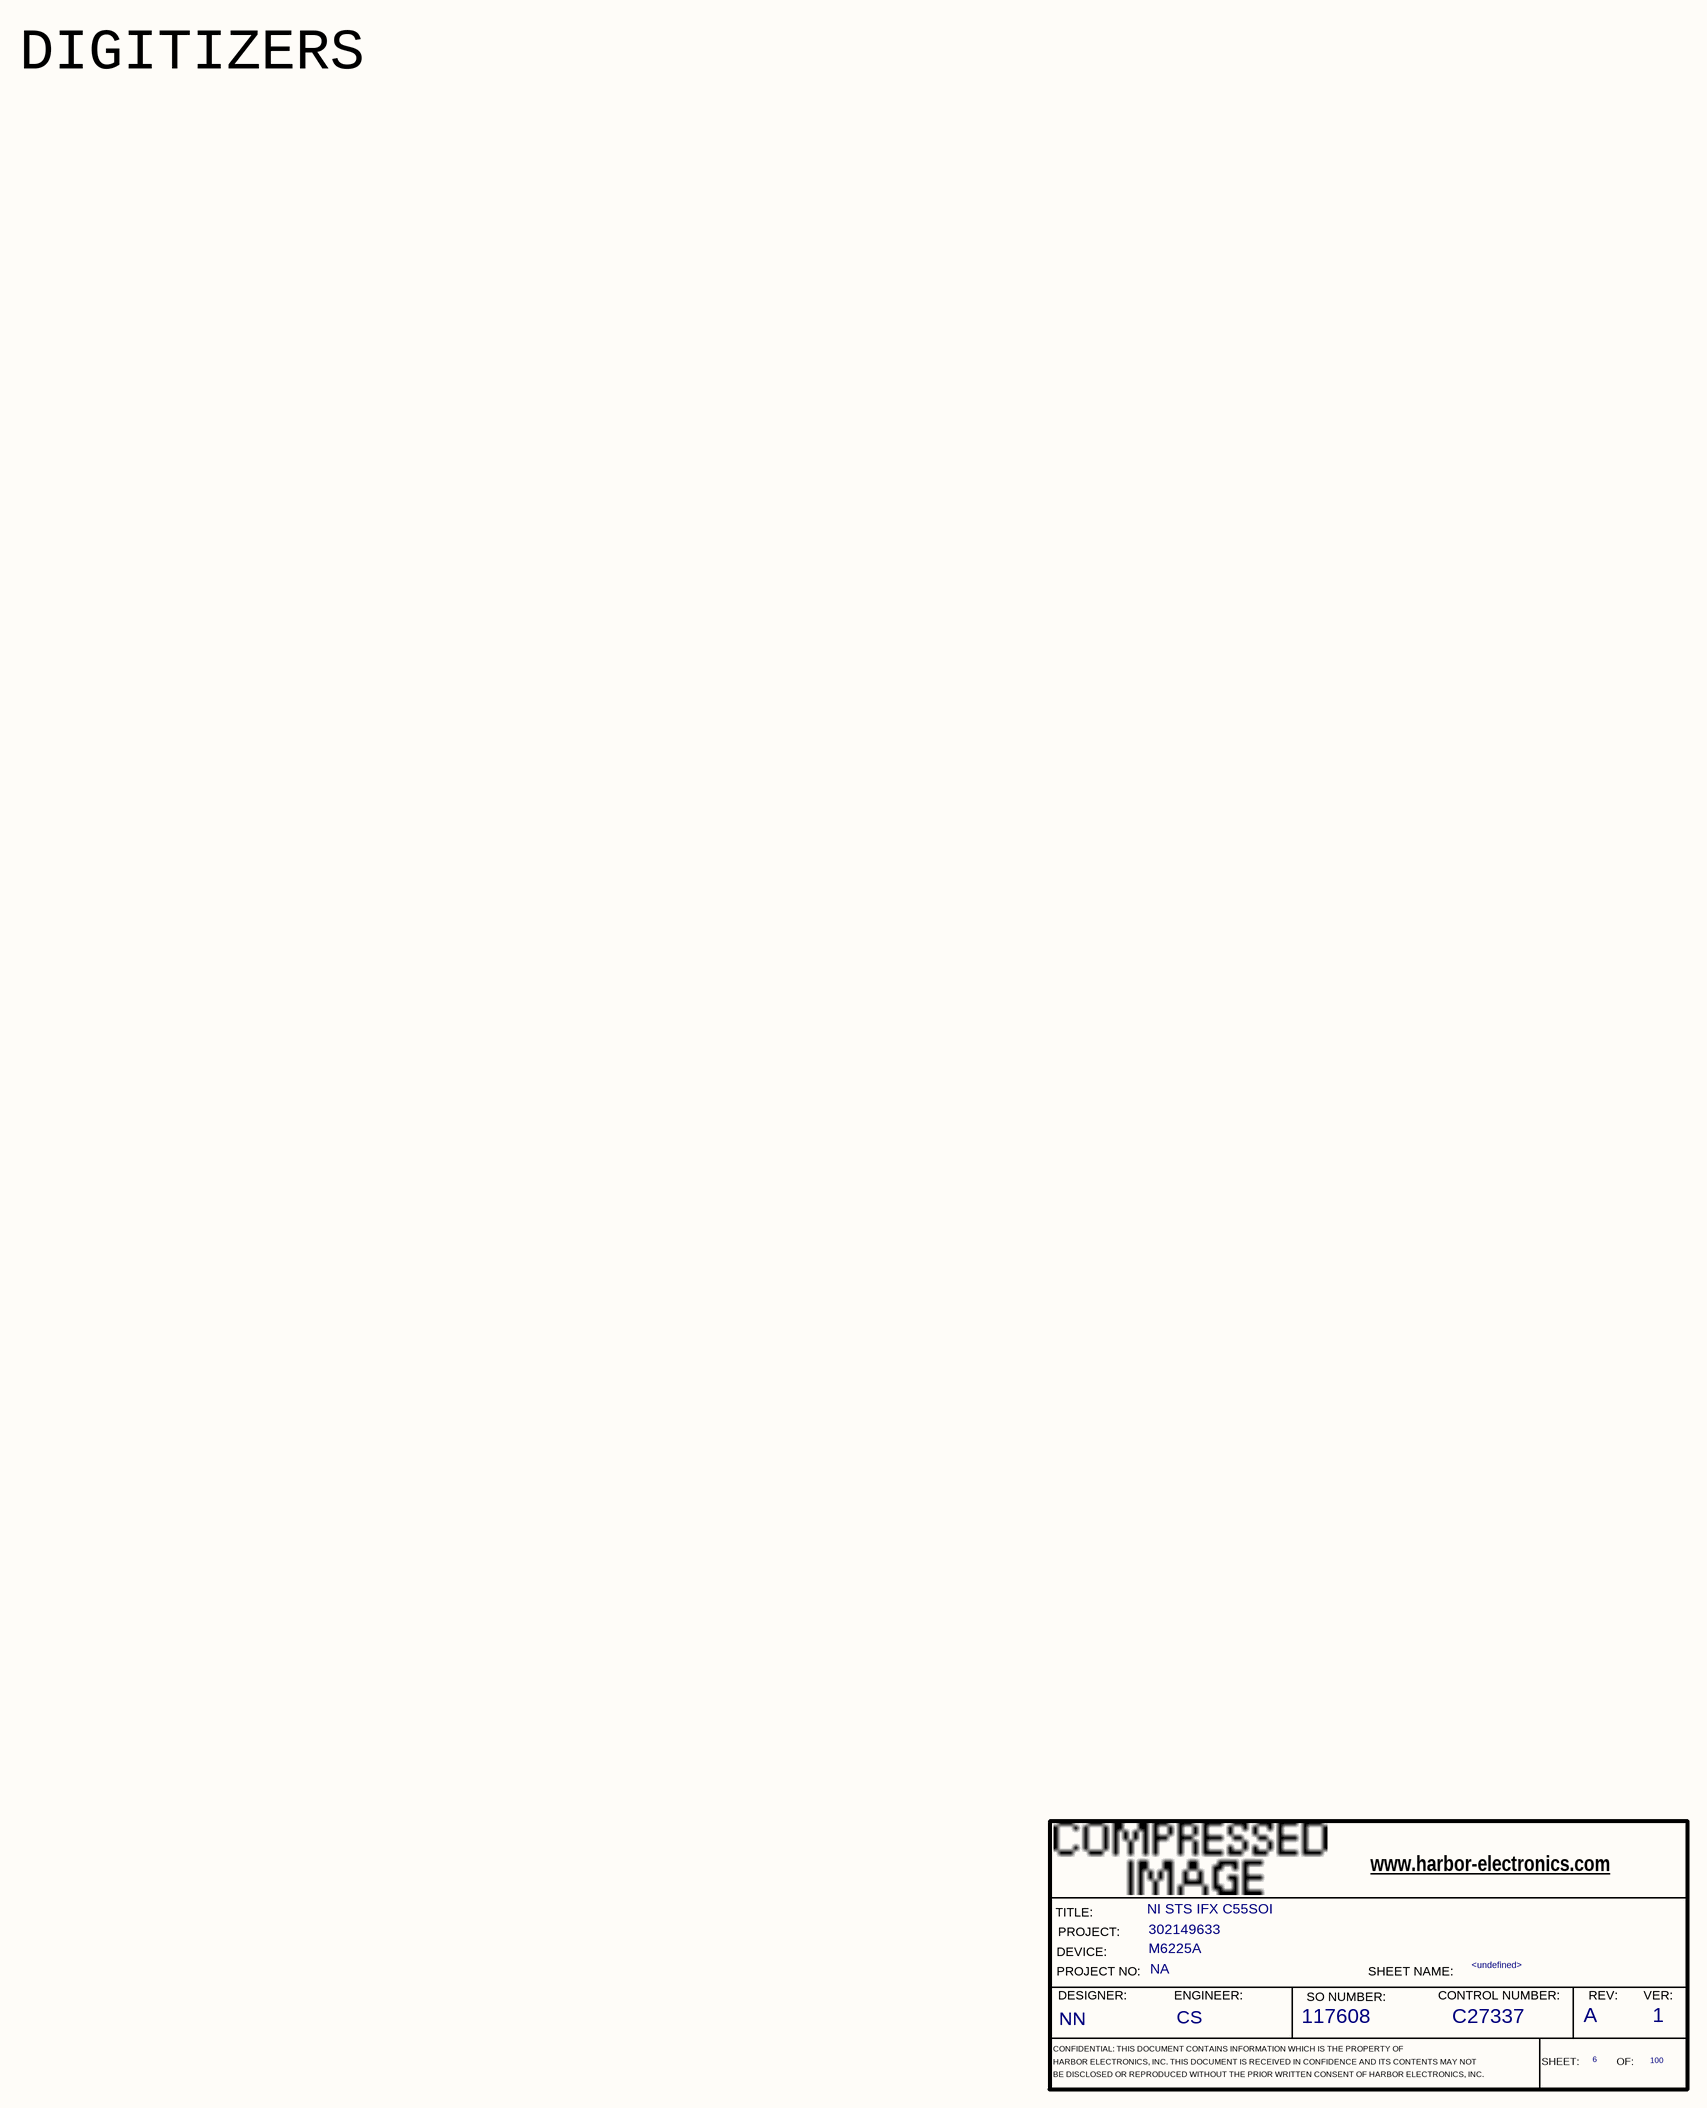
[diagram p21: 41-DIGITIZERS.SchDoc]

### Parts
(Parts that share a designator on the sheet are numbered #1, #2 ... from top to bottom, then left to right.)
*#7  RevCode: A  Title: NI STS IFX C55SOI  Page Number: 6  Page Count: 100  Engineer: CS  Designer: NN  SO Number: 117608  Control Number: C27337  Version: 1  Page Name: <undefined>  PROJECT: 302149633  DEVICE: M6225A  PROJECT NO.: NA  (hidden comment: HE_DEFAULT)  (graphical)

### Notes on the sheet
- DIGITIZERS
- (in symbol HE_DEFAULT) www.harbor-electronics.com; TITLE:; PROJECT:; DEVICE:; PROJECT NO:; SHEET NAME:; DESIGNER:; ENGINEER:; SO NUMBER:; CONTROL NUMBER:; REV:; VER:; CONFIDENTIAL: THIS DOCUMENT CONTAINS INFORMATION WHICH IS THE PROPERTY OF; HARBOR ELECTRONICS, INC. THIS DOCUMENT IS RECEIVED IN CONFIDENCE AND ITS CONTENTS MAY NOT; SHEET:; OF:; BE DISCLOSED OR REPRODUCED WITHOUT THE PRIOR WRITTEN CONSENT OF HARBOR ELECTRONICS, INC.

### Library data of the parts
*#7 = HE_DEFAULT: as *#1 on sheet 01-TITLE

## Sheet 42-MIO.SchDoc
size 594 x 420 mm
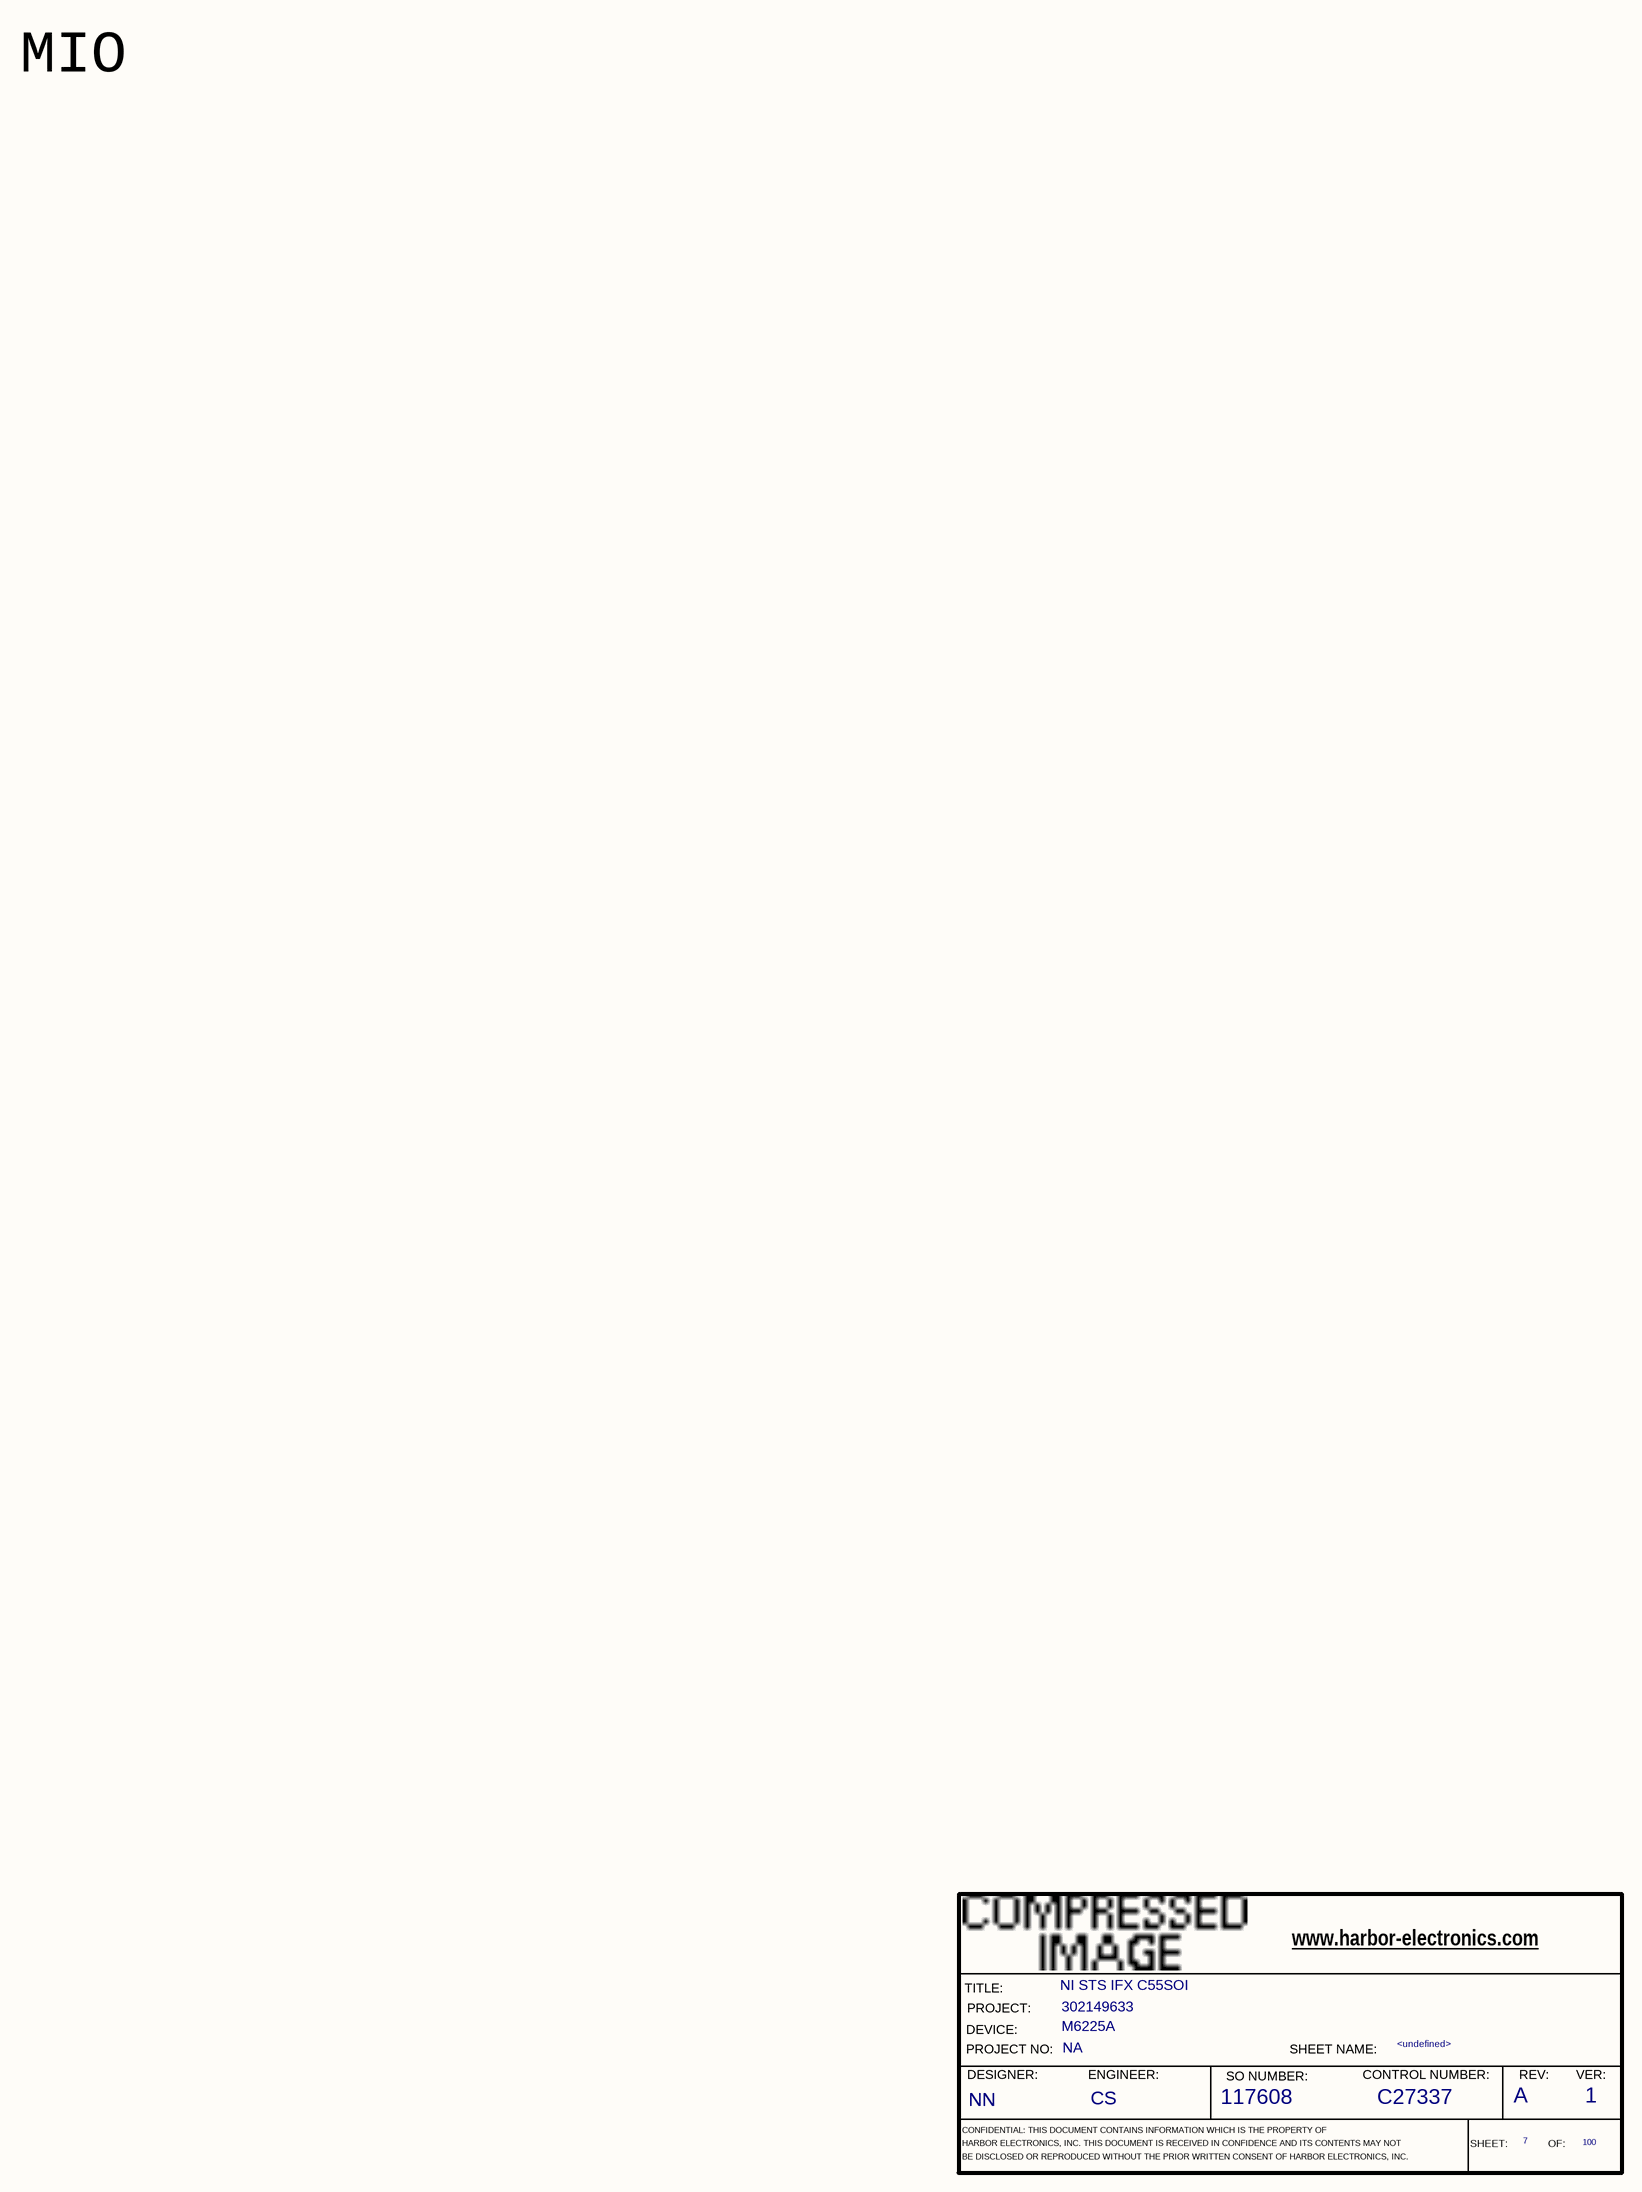
[diagram p22: 42-MIO.SchDoc]

### Parts
(Parts that share a designator on the sheet are numbered #1, #2 ... from top to bottom, then left to right.)
*#8  RevCode: A  Title: NI STS IFX C55SOI  Page Number: 7  Page Count: 100  Engineer: CS  Designer: NN  SO Number: 117608  Control Number: C27337  Version: 1  Page Name: <undefined>  PROJECT: 302149633  DEVICE: M6225A  PROJECT NO.: NA  (hidden comment: HE_DEFAULT)  (graphical)

### Notes on the sheet
- MIO
- (in symbol HE_DEFAULT) www.harbor-electronics.com; TITLE:; PROJECT:; DEVICE:; PROJECT NO:; SHEET NAME:; DESIGNER:; ENGINEER:; SO NUMBER:; CONTROL NUMBER:; REV:; VER:; CONFIDENTIAL: THIS DOCUMENT CONTAINS INFORMATION WHICH IS THE PROPERTY OF; HARBOR ELECTRONICS, INC. THIS DOCUMENT IS RECEIVED IN CONFIDENCE AND ITS CONTENTS MAY NOT; SHEET:; OF:; BE DISCLOSED OR REPRODUCED WITHOUT THE PRIOR WRITTEN CONSENT OF HARBOR ELECTRONICS, INC.

### Library data of the parts
*#8 = HE_DEFAULT: as *#1 on sheet 01-TITLE